# EAGLE design Falange (EAGLE 7.6.0)
CNAME: OffGrid-Devices Falange; CREVISION: B; DESIGNER: Tiago Angelo
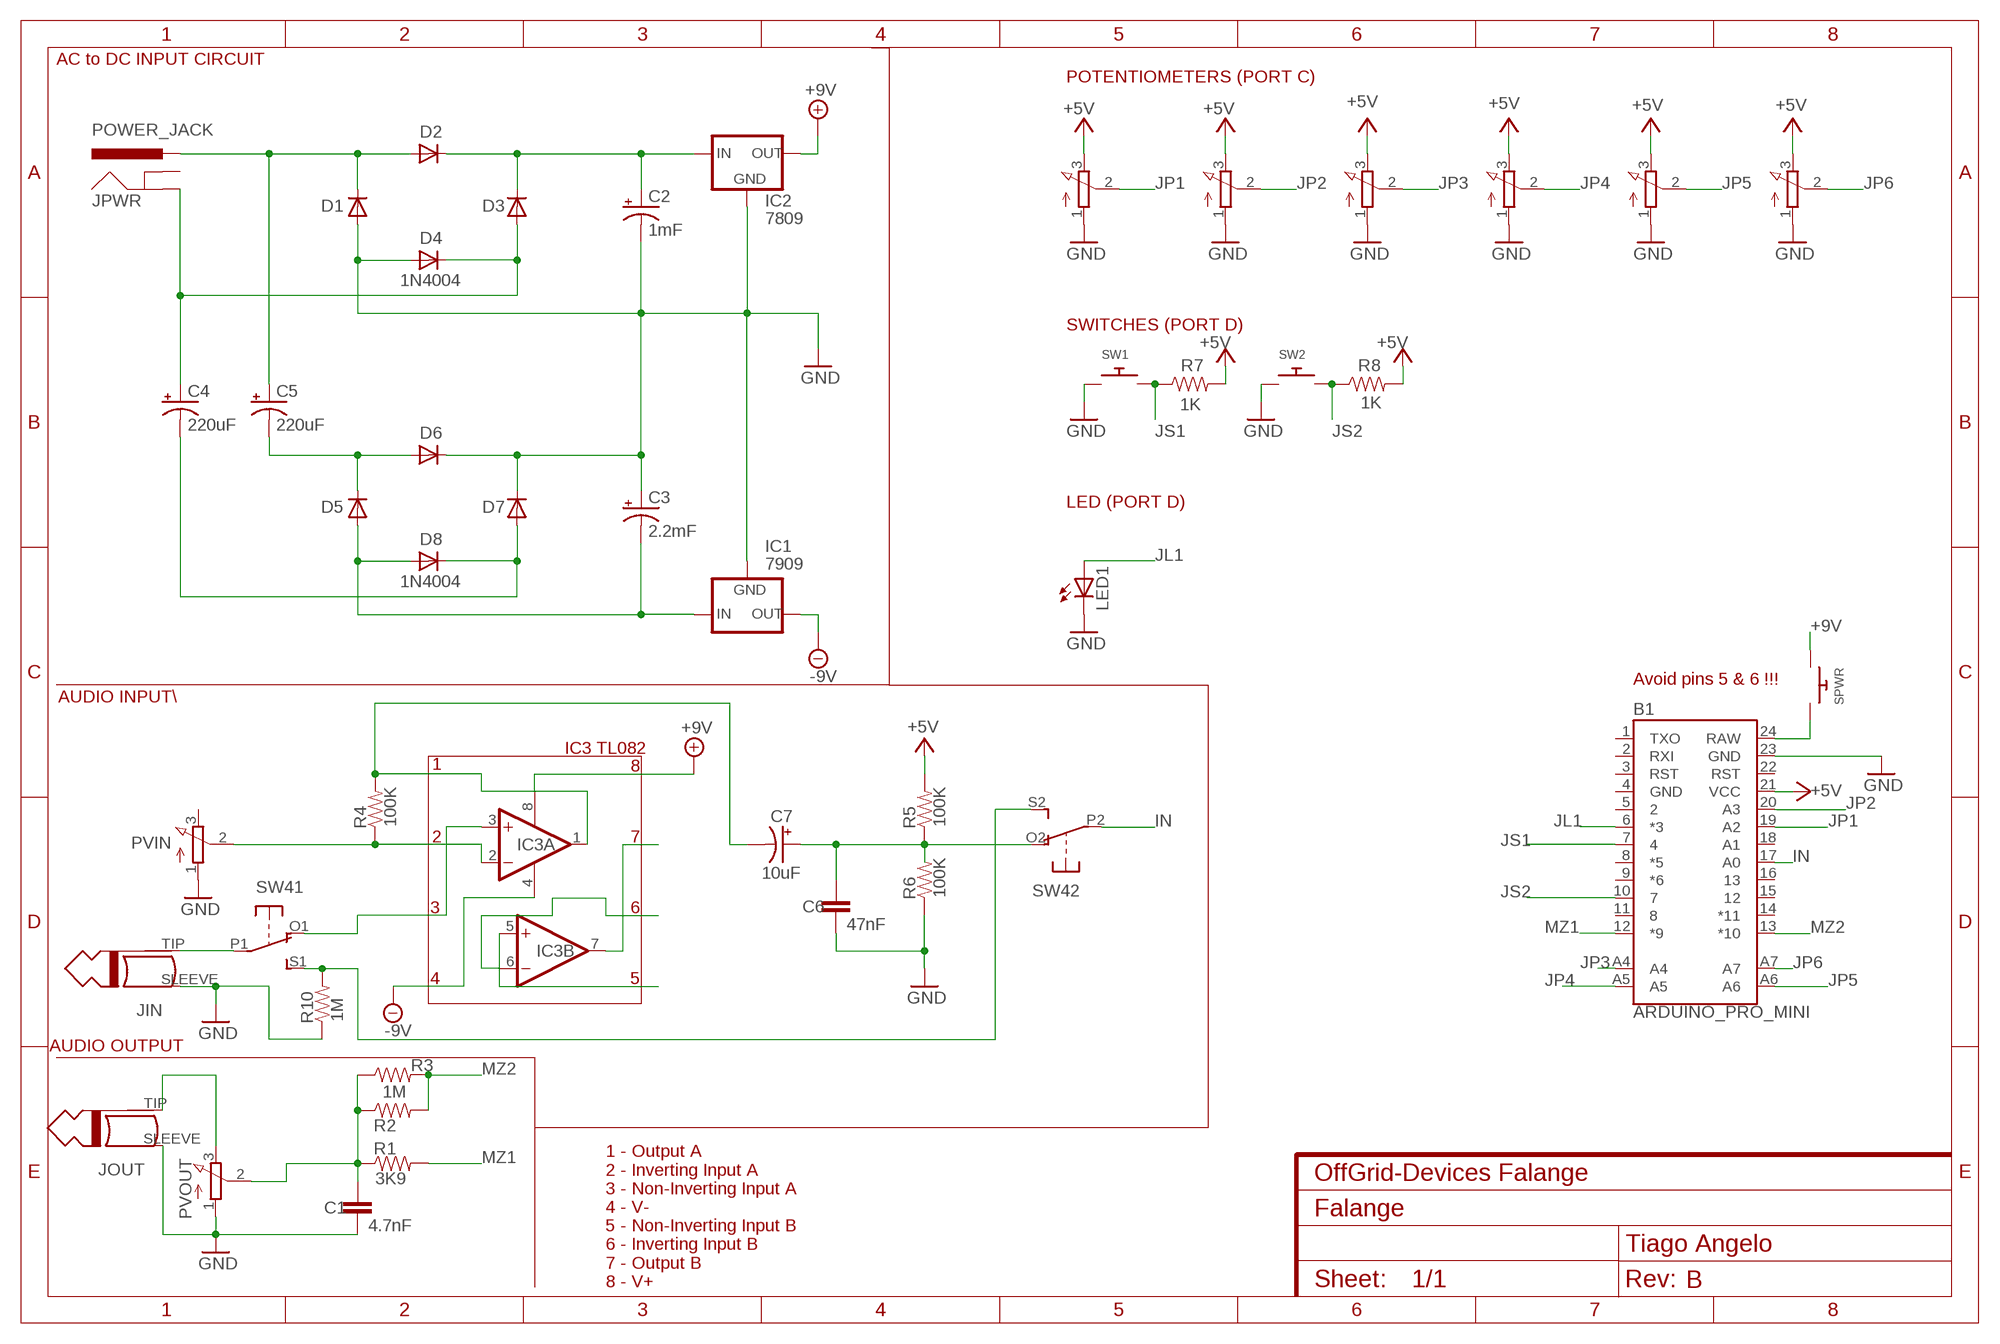
[diagram p0: schematic, sheet 1]

## Parts
B1  ARDUINO_PRO_MINI  [ARDUINO_PRO_MINI]
C1  4.7nF  C-EU050-025X075  [C050-025X075]
C2  1mF  CPOL-USE30-16AXIAL  [E30-16]
C3  2.2mF  CPOL-USE35-16AXIAL  [E35-16]
C4  220uF  CPOL-USE5-10.5  [E5-10,5]
C5  220uF  CPOL-USE5-10.5  [E5-10,5]
C6  47nF  C-EU050-025X075  [C050-025X075]
C7  10uF  CPOL-USE2.5-6  [E2,5-6]
D1  1N4004  [DO41-10]
D2  1N4004  [DO41-10]
D3  1N4004  [DO41-10]
D4  1N4004  [DO41-10]
D5  1N4004  [DO41-10]
D6  1N4004  [DO41-10]
D7  1N4004  [DO41-10]
D8  1N4004  [DO41-10]
IC1  7909  79XXL  [79XXL]
IC2  7809  78XXL  [78XXL]
IC3  TL082P  [DIL08]
JIN  MONO_PLUG  [TWO_PADS]
JOUT  MONO_PLUG  [TWO_PADS]
JPWR  POWER_JACK  [POWER_JACK_PTH]
LED1  LED3MM  [LED3MM]
P1  3RP/1610N  [3RP/1610N]
P2  3RP/1610N  [3RP/1610N]
P3  3RP/1610N  [3RP/1610N]
P4  3RP/1610N  [3RP/1610N]
P5  3RP/1610N  [3RP/1610N]
P6  3RP/1610N  [3RP/1610N]
PVIN  3RP/1610N  [3RP/1610N]
PVOUT  3RP/1610N  [3RP/1610N]
R1  3K9  1KOHM-HORIZ-1/4W-5%  [AXIAL-0.3]
R2  1M  1KOHM-HORIZ-1/4W-5%  [AXIAL-0.3]
R3  1M  1KOHM-HORIZ-1/4W-5%  [AXIAL-0.3]
R4  100K  1KOHM-HORIZ-1/4W-5%  [AXIAL-0.3]
R5  100K  1KOHM-HORIZ-1/4W-5%  [AXIAL-0.3]
R6  100K  1KOHM-HORIZ-1/4W-5%  [AXIAL-0.3]
R7  1K  1KOHM-HORIZ-1/4W-5%  [AXIAL-0.3]
R8  1K  1KOHM-HORIZ-1/4W-5%  [AXIAL-0.3]
R10  1M  1KOHM-HORIZ-1/4W-5%  [AXIAL-0.3]
SPWR  SWITCH_PUSHBUTTONEVQ-PE  [TACT_PANA-EVQ]
SW1  SWITCH_PUSHBUTTONEVQ-PE  [TACT_PANA-EVQ]
SW2  SWITCH_PUSHBUTTONEVQ-PE  [TACT_PANA-EVQ]
SW4  DPDT-EG1390  [EG1390]

## Nets
+5V: B1.21(VCC) P1.3(E) P2.3(E) P3.3(E) P4.3(E) P5.3(E) P6.3(E) R5.P$2 R7.P$2 R8.P$2
+9V: IC2.OUT IC3.8(P:V+) SPWR.P$1
-9V: IC1.OUT IC3.4(P:V-)
GND: B1.23(GND) C1.2 C2.- C3.+ C6.2 D1.A D4.A D6.C D7.C IC1.GND IC2.GND JIN.SLEEVE JOUT.SLEEVE LED1.K(C) P1.1(A) P2.1(A) P3.1(A) P4.1(A) P5.1(A) P6.1(A) PVIN.1(A) PVOUT.1(A) R6.P$1 R10.P$1 SW1.P$1 SW2.P$1
IN: B1.17(A0) R5.P$1 R6.P$2 SW4.P2(2:P)
JL1: B1.6(*3) LED1.A
JP1: B1.19(A2) P1.2(S)
JP2: B1.20(A3) P2.2(S)
JP3: B1.A4 P3.2(S)
JP4: B1.A5 P4.2(S)
JP5: B1.A6 P5.2(S)
JP6: B1.A7 P6.2(S)
JP8-2: C1.1 PVOUT.2(S) R1.P$1 R2.P$1 R3.P$1
JP8-3: JOUT.TIP PVOUT.3(E)
JS1: B1.7 R7.P$1 SW1.P$2
JS2: B1.10 R8.P$1 SW2.P$2
MZ1: B1.12(*9) R1.P$2
MZ2: B1.13(*10) R2.P$2 R3.P$2
N$2: C5.- D5.C D6.A
N$4: C4.- D7.A D8.C
N$5: C2.+ D2.C D3.C IC2.IN
N$6: B1.24(RAW) SPWR.P$2
N$7: C3.- D5.A D8.A IC1.IN
N$8: C7.- IC3.1(A:OUT) R4.P$2
N$9: IC3.2(A:-IN) PVIN.2(S) R4.P$1
N$10: JIN.TIP SW4.P1(1:P)
N$11: R10.P$2 SW4.S1(1:S) SW4.S2(2:S)
N$12: IC3.7(B:OUT)
N$13: IC3.6(B:-IN)
N$14: IC3.5(B:+IN)
N$15: IC3.3(A:+IN) SW4.O1(1:O)
N$32: C6.1 C7.+ SW4.O2(2:O)
PWRSLV: C4.+ D3.A D4.C JPWR.GND
PWRTIP: C5.+ D1.C D2.A JPWR.PWR
Unconnected: B1.1(TXO) B1.2(RXI) B1.3(RST) B1.5 B1.8(*5) B1.9(*6) B1.11 B1.14(*11) B1.15 B1.16 B1.18(A1) B1.22(RST) JPWR.GNDBREAK PVIN.3(E)

## Notes on the sheet
- AC to DC INPUT CIRCUIT
- POTENTIOMETERS (PORT C)
- SWITCHES (PORT D)
- LED (PORT D)
- Avoid pins 5 & 6 !!!
- AUDIO INPUT\
- IC3 TL082
- 1 | 8
- 2 | 7
- 3 | 6
- 4 | 5
- AUDIO OUTPUT
- 1 - Output A
  2 - Inverting Input A
  3 - Non-Inverting Input A
  4 - V-
  5 - Non-Inverting Input B
  6 - Inverting Input B
  7 - Output B
  8 - V+

## Power pins joined to a net without a drawn wire
GND: B1.4(GND)

## Library data of the parts
B1 = SparkFun-Boards:ARDUINO_PRO_MINI: SparkFun Pro Mini Pro Mini compatible footprint. Dimensions: 0.7 x 1.3" PCB Thickness: 0.8mm SparkFun Products: 3.3V/8MHz <https://www.sparkfun.com/products/11114> 5V/16MHz <https://www.sparkfun.com/products/11113>
C1 C6 = rcl:C-EU: CAPACITOR, European symbol
C2 C3 = offgrid-devices:CPOL-US: POLARIZED CAPACITOR, American symbol
C4 C5 C7 = rcl:CPOL-US: POLARIZED CAPACITOR, American symbol
D1-D8 = adafruit:1N4004: DIODE General purpose 1N400x type rectifier (With bigger pads) http://www.ladyada.net/library/pcb/eaglelibrary.html
IC1 = v-reg:79XXL: VOLTAGE REGULATOR
IC2 = v-reg:78XXL: VOLTAGE REGULATOR
IC3 = linear:TL082: OP AMP Data sheet <http://www.ti.com/lit/ds/symlink/tl084a . pdf>; DATA_SHEET: <a href="http://www.ti.com/lit/ds/symlink/tl084a.pdf"> Data sheet </a>
JIN JOUT = gm-jacks:MONO_PLUG
JPWR = SparkFun-Connectors:POWER_JACK: Power Jack Connector This is the standard 5.5mm barrel jack for power. The PTH is the most common, proven, reliable, footprint. The Slot footprint only works if the mill layer is transmitted to the PCB fab house so be warned. Here are the connectors we sell at SparkFun: DC Barrel Power Jack/Connector <https://www.sparkfun.com/products/119> (PRT-00119) DC Barrel Power Jack/Connector (SMD) <https://www.sparkfun.com/products/12748> (PRT-12748) DC Barrel Jack Adapter - Breadboard Compatible <https://www.sparkfun.com/products/10811> (PRT-10811) It is used on this SparkFun product (and many, many others): SparkFun RedBoard - Programmed with Arduino <https://www.sparkfun.com/products/12757> (DEV-12757) Also, if you need a mating power supply or connector, please check these out: Wall Adapter Power Supply - 9VDC 650mA <https://www.sparkfun.com/products/298> (TOL-00298) DC Barrel Jack Adapter - Male <https://www.sparkfun.com/products/10287> (PRT-10287); PROD_ID: CONN-08197
LED1 = led:LED: LED OSRAM: - CHIPLED LG R971, LG N971, LY N971, LG Q971, LY Q971, LO R971, LY R971 LH N974, LH R974 LS Q976, LO Q976, LY Q976 LO Q996 - Hyper CHIPLED LW Q18S LB Q993, LB Q99A, LB R99A - SideLED LS A670, LO A670, LY A670, LG A670, LP A670 LB A673, LV A673, LT A673, LW A673 LH A674 LY A675 LS A676, LA A676, LO A676, LY A676, LW A676 LS A679, LY A679, LG A679 - Hyper Micro SIDELED® LS Y876, LA Y876, LO Y876, LY Y876 LT Y87S - SmartLED LW L88C, LW L88S LB L89C, LB L89S, LG L890 LS L89K, LO L89K, LY L89K LS L896, LA L896, LO L896, LY L896 - TOPLED LS T670, LO T670, LY T670, LG T670, LP T670 LSG T670, LSP T670, LSY T670, LOP T670, LYG T670 LG T671, LOG T671, LSG T671 LB T673, LV T673, LT T673, LW T673 LH T674 LS T676, LA T676, LO T676, LY T676, LB T676, LH T676, LSB T676, LW T676 LB T67C, LV T67C, LT T67C, LS T67K, LO T67K, LY T67K, LW E67C LS E67B, LA E67B, LO E67B, LY E67B, LB E67C, LV E67C, LT E67C LW T67C LS T679, LY T679, LG T679 LS T770, LO T770, LY T770, LG T770, LP T770 LB T773, LV T773, LT T773, LW T773 LH T774 LS E675, LA E675, LY E675, LS T675 LS T776, LA T776, LO T776, LY T776, LB T776 LHGB T686 LT T68C, LB T68C - Hyper Mini TOPLED® LB M676 - Mini TOPLED Santana® LG M470 LS M47K, LO M47K, LY M47K Source: http://www.osram.convergy.de LUXEON: - LUMILED® LXK2-PW12-R00, LXK2-PW12-S00, LXK2-PW14-U00, LXK2-PW14-V00 LXK2-PM12-R00, LXK2-PM12-S00, LXK2-PM14-U00 LXK2-PE12-Q00, LXK2-PE12-R00, LXK2-PE12-S00, LXK2-PE14-T00, LXK2-PE14-U00 LXK2-PB12-K00, LXK2-PB12-L00, LXK2-PB12-M00, LXK2-PB14-N00, LXK2-PB14-P00, LXK2-PB14-Q00 LXK2-PR12-L00, LXK2-PR12-M00, LXK2-PR14-Q00, LXK2-PR14-R00 LXK2-PD12-Q00, LXK2-PD12-R00, LXK2-PD12-S00 LXK2-PH12-R00, LXK2-PH12-S00 LXK2-PL12-P00, LXK2-PL12-Q00, LXK2-PL12-R00 Source: www.luxeon.com KINGBRIGHT: KA-3528ASYC Source: www.kingbright.com
P1-P6 PVIN PVOUT = pot:3RP/1610N: 16mm Potentiometer one level Source: http://www.alphapotentiometers.net/html/16mm_pot_2.html
R1-R8 R10 = SparkFun-Resistors:1KOHM: 1kΩ resistor A resistor is a passive two-terminal electrical component that implements electrical resistance as a circuit element. Resistors act to reduce current flow, and, at the same time, act to lower voltage levels within circuits. - Wikipedia; PROD_ID: RES-08380; VALUE: 1k
SPWR SW1 SW2 = adafruit:SWITCH_PUSHBUTTON: Buttons SOFTTOUCHSMD_SJ - Soft touch temporary push button (Super Junk Akihabara) Compatible with SKPMANE010 [Mouser: 688-SKPMAN] C&K_KSS = Digikey: KSS221GLFS
SW4 = adafruit:DPDT

## Net classes
0 default: width 0.508 mm, drill 0.508 mm, clearance 0.406 mm

## Board
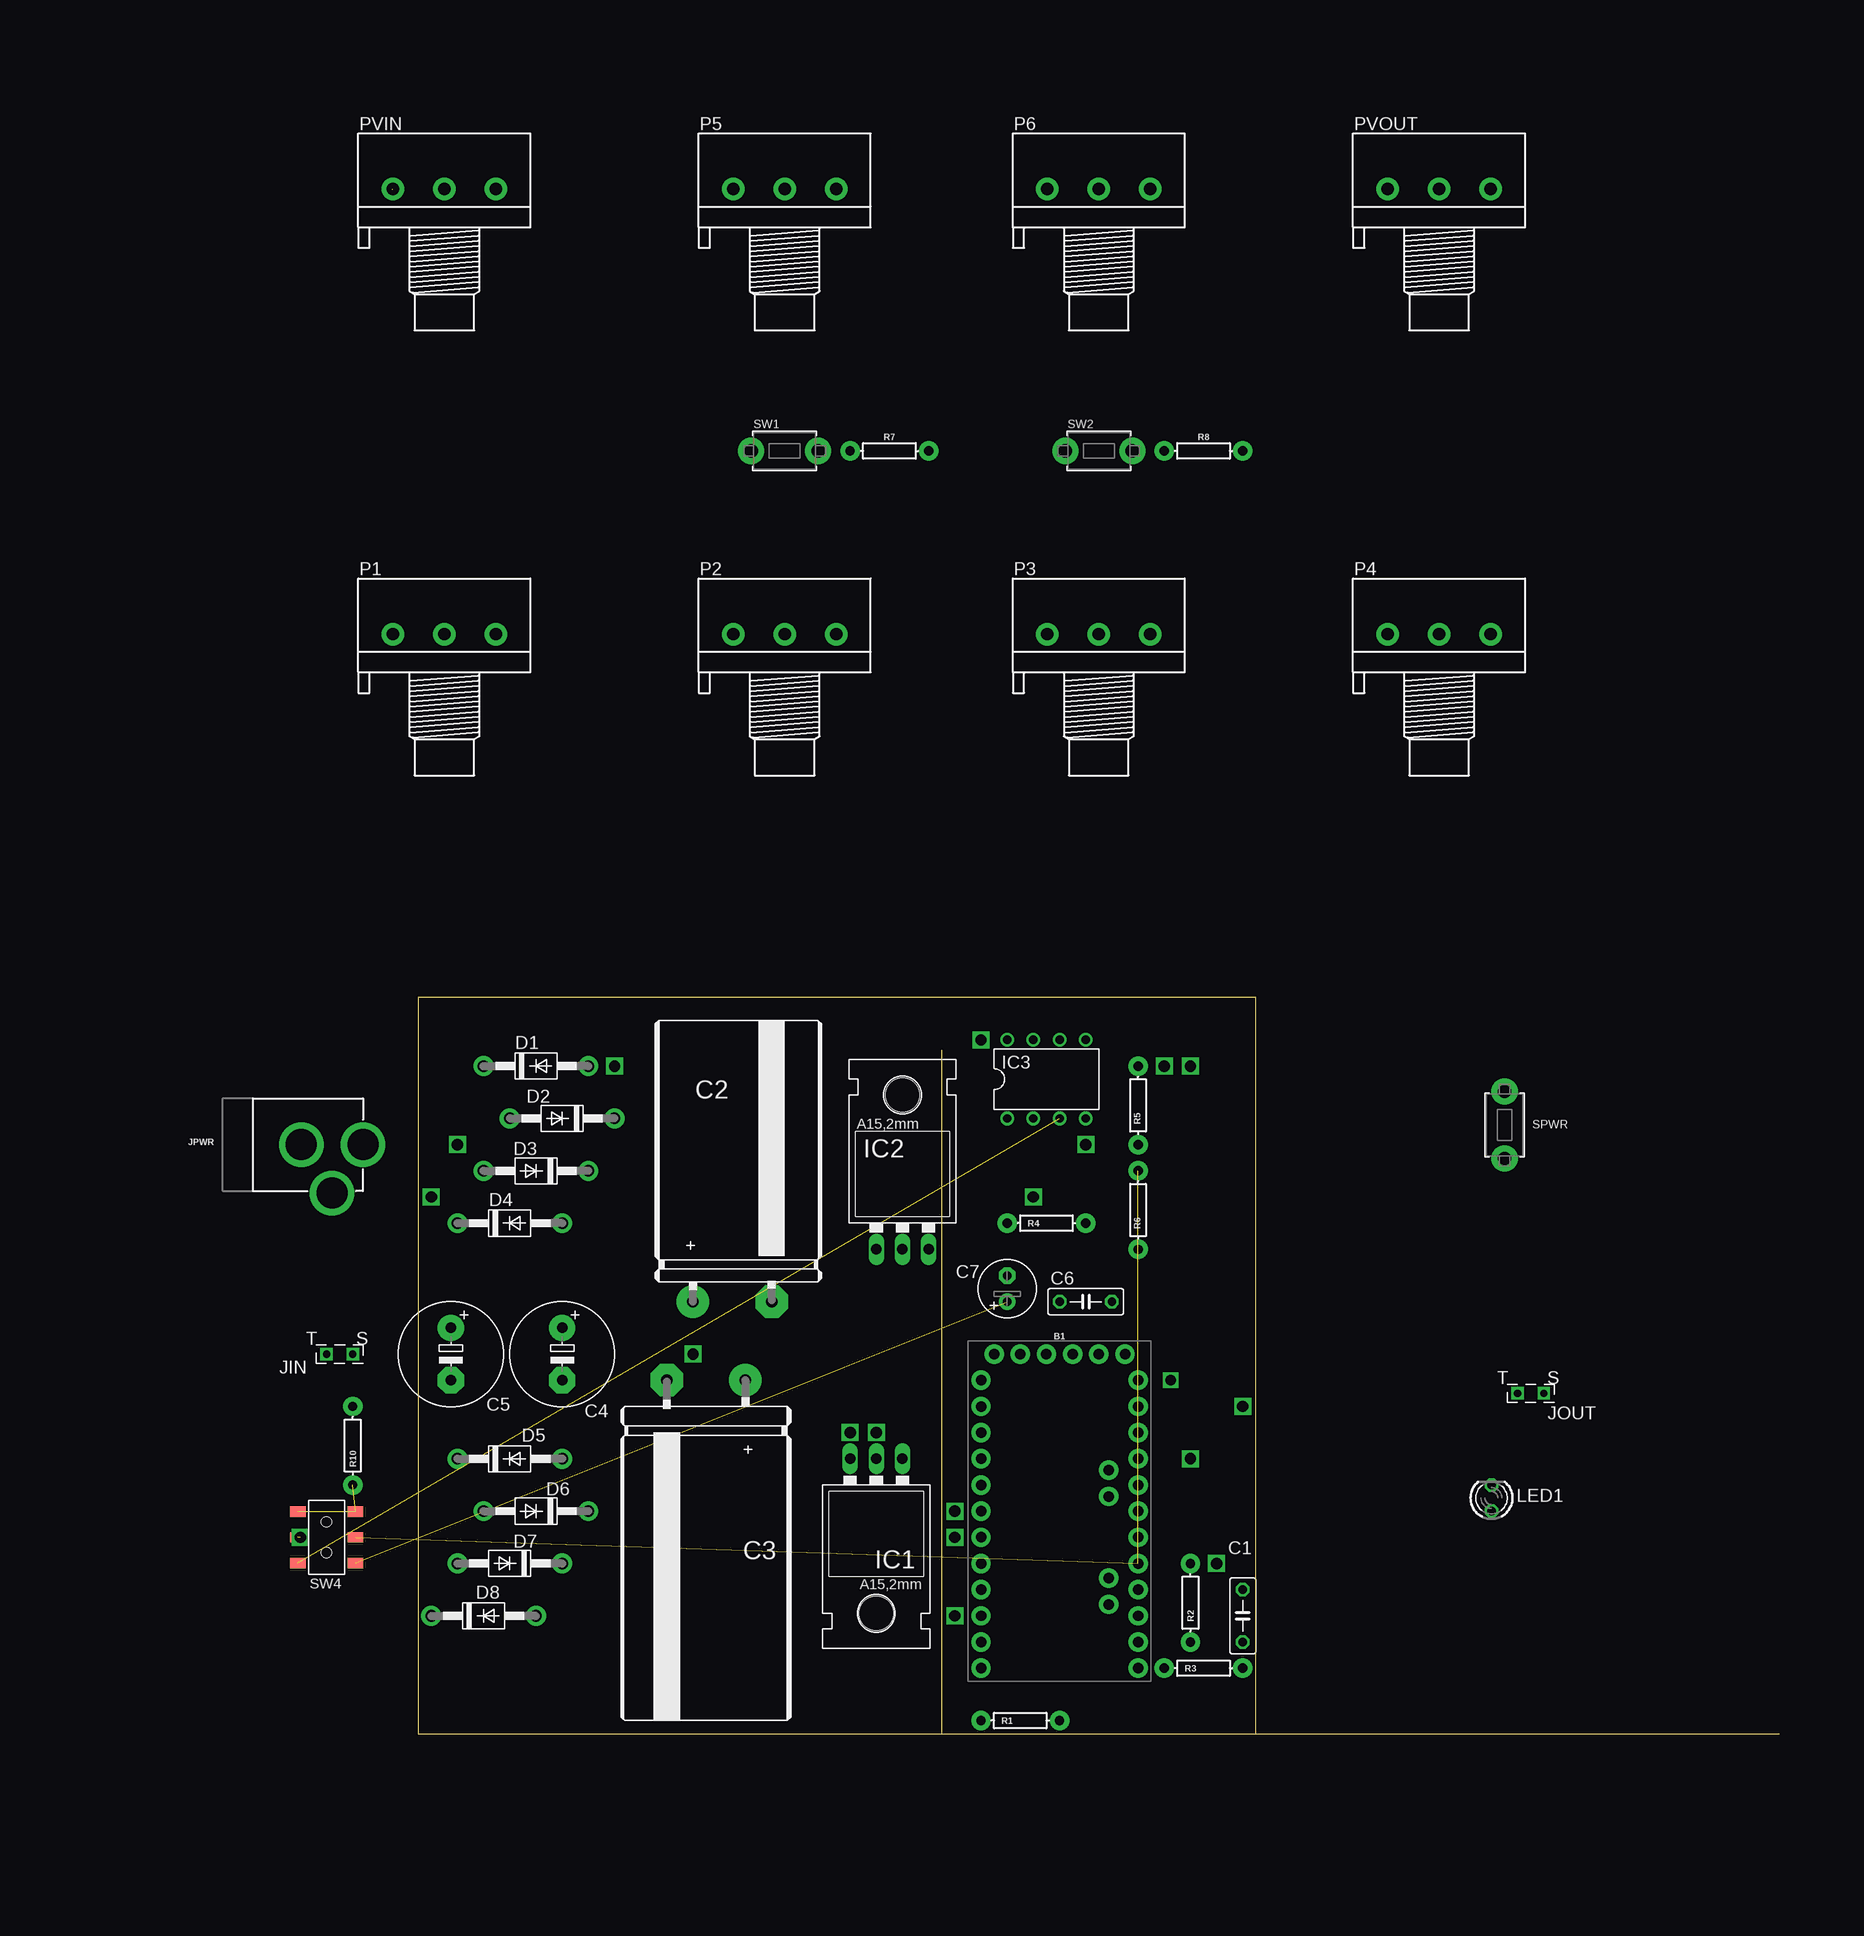
[diagram p1: board, top side]
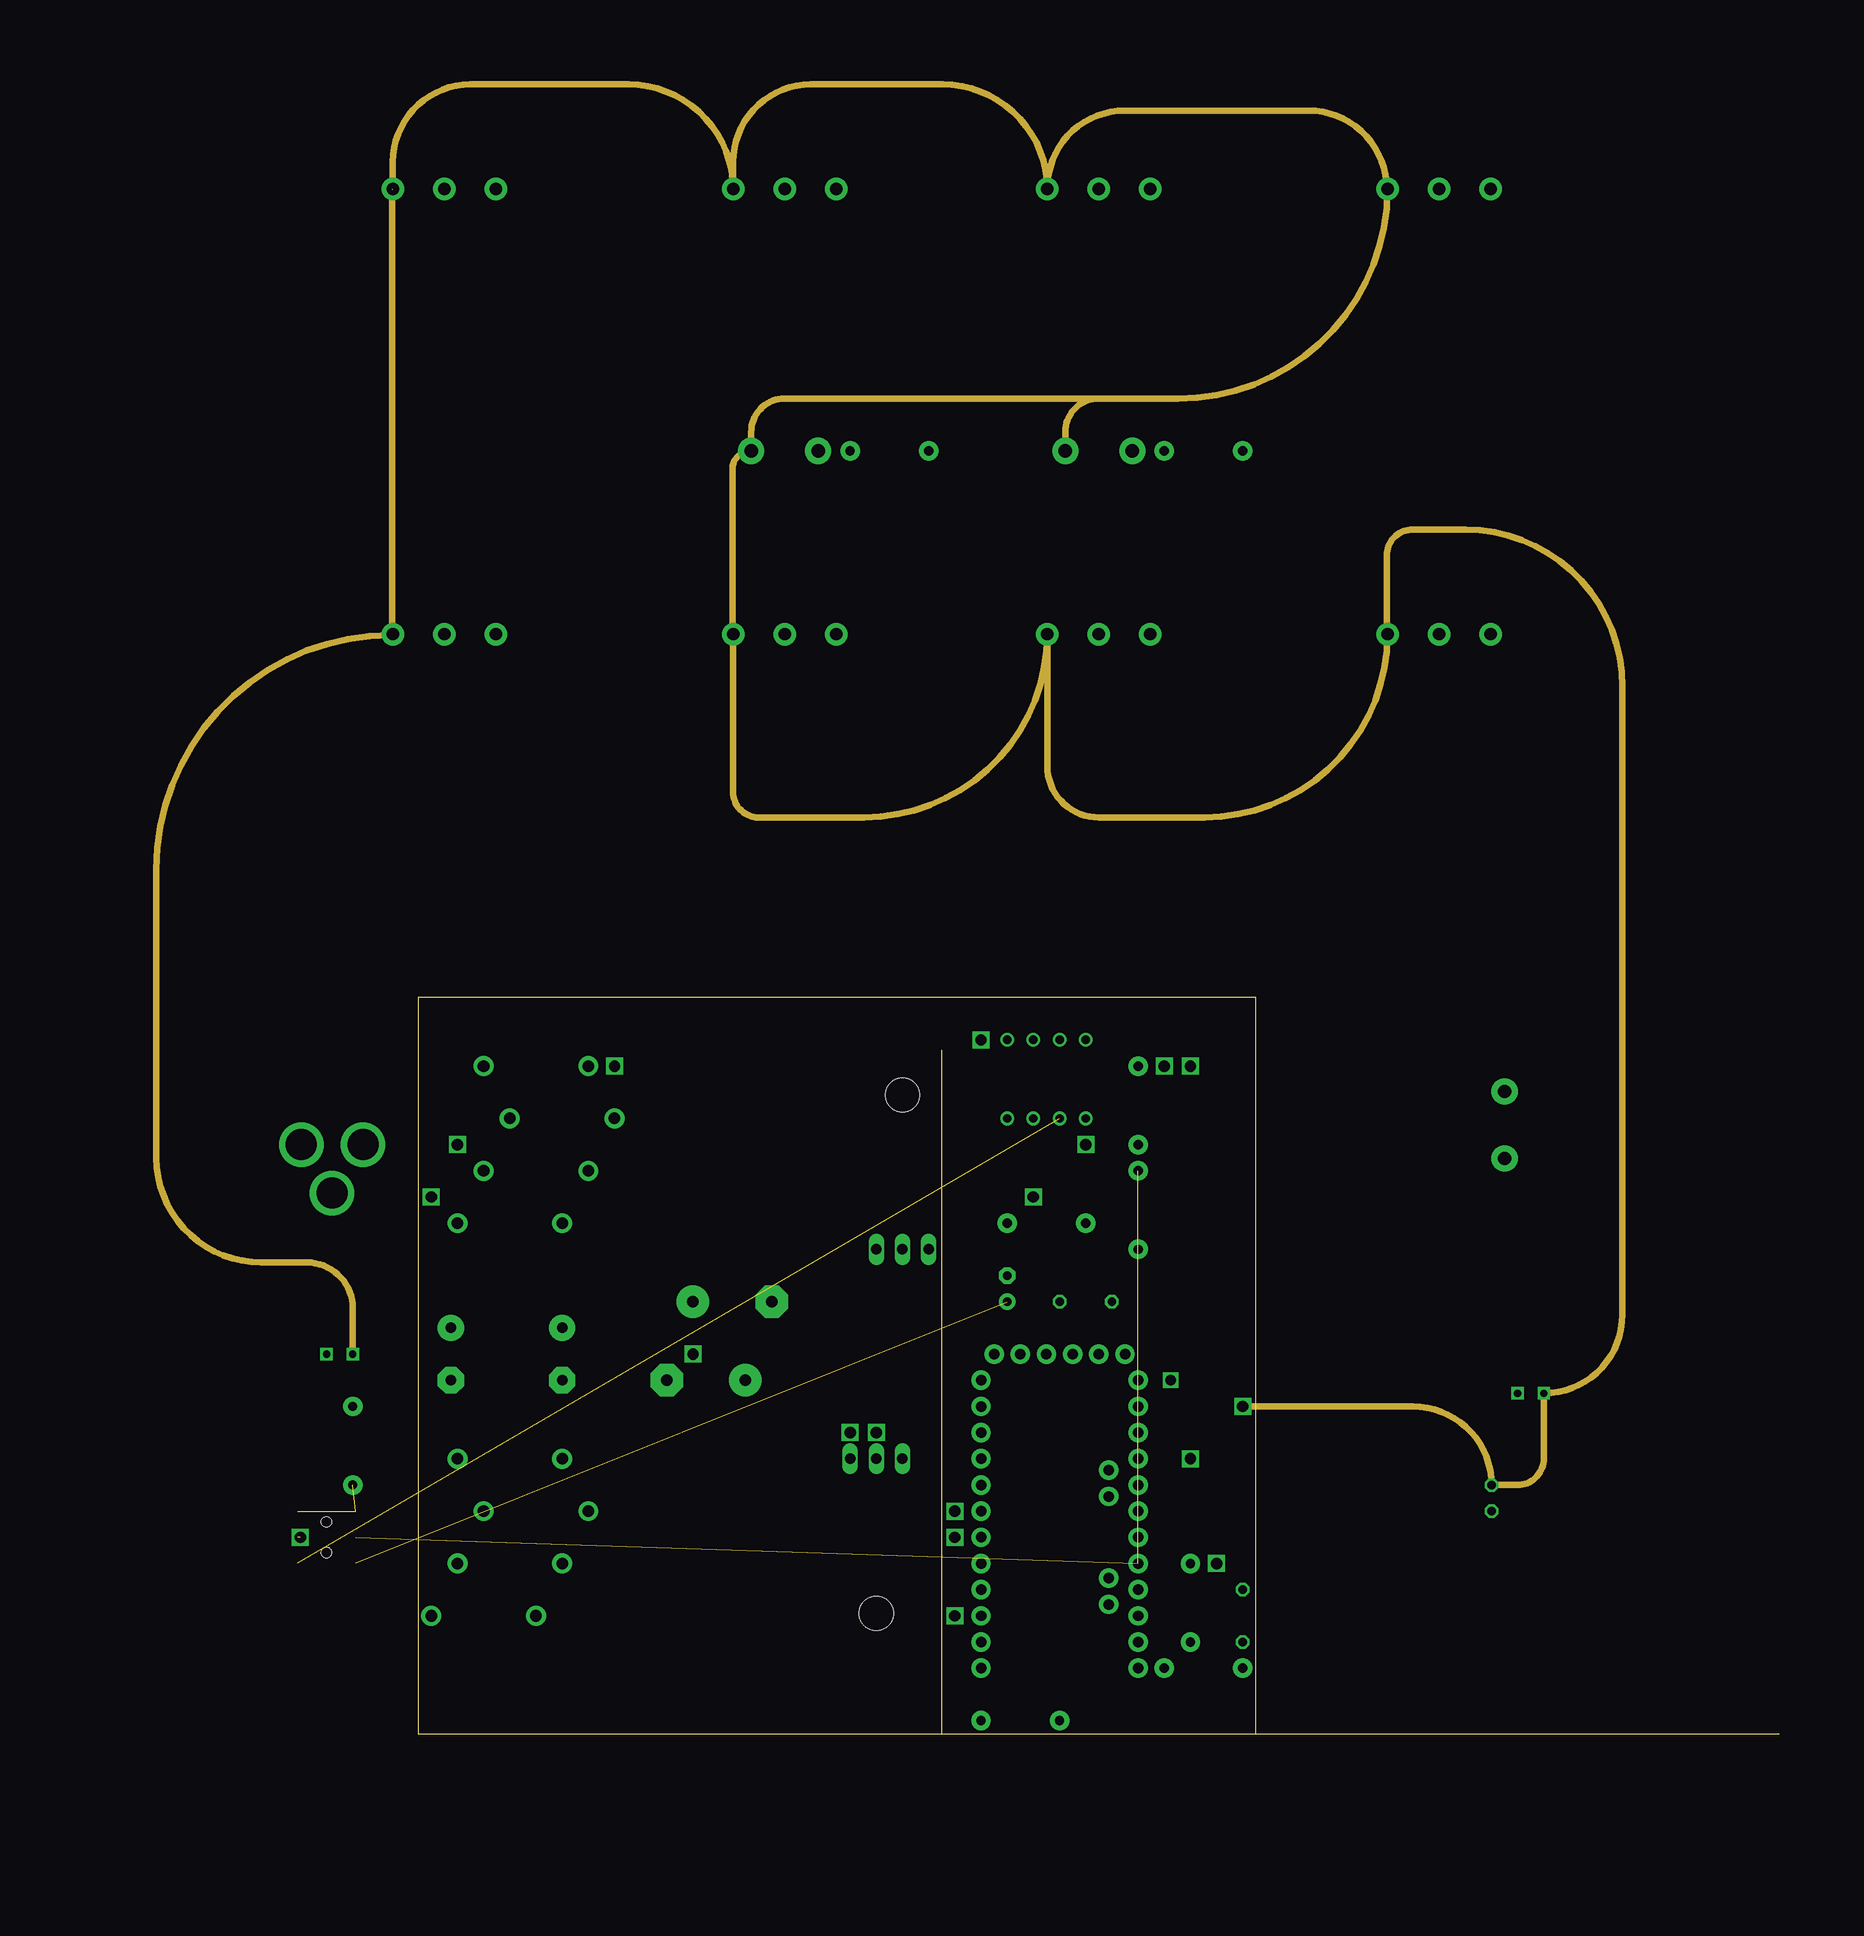
[diagram p2: board, inner layer Ground]
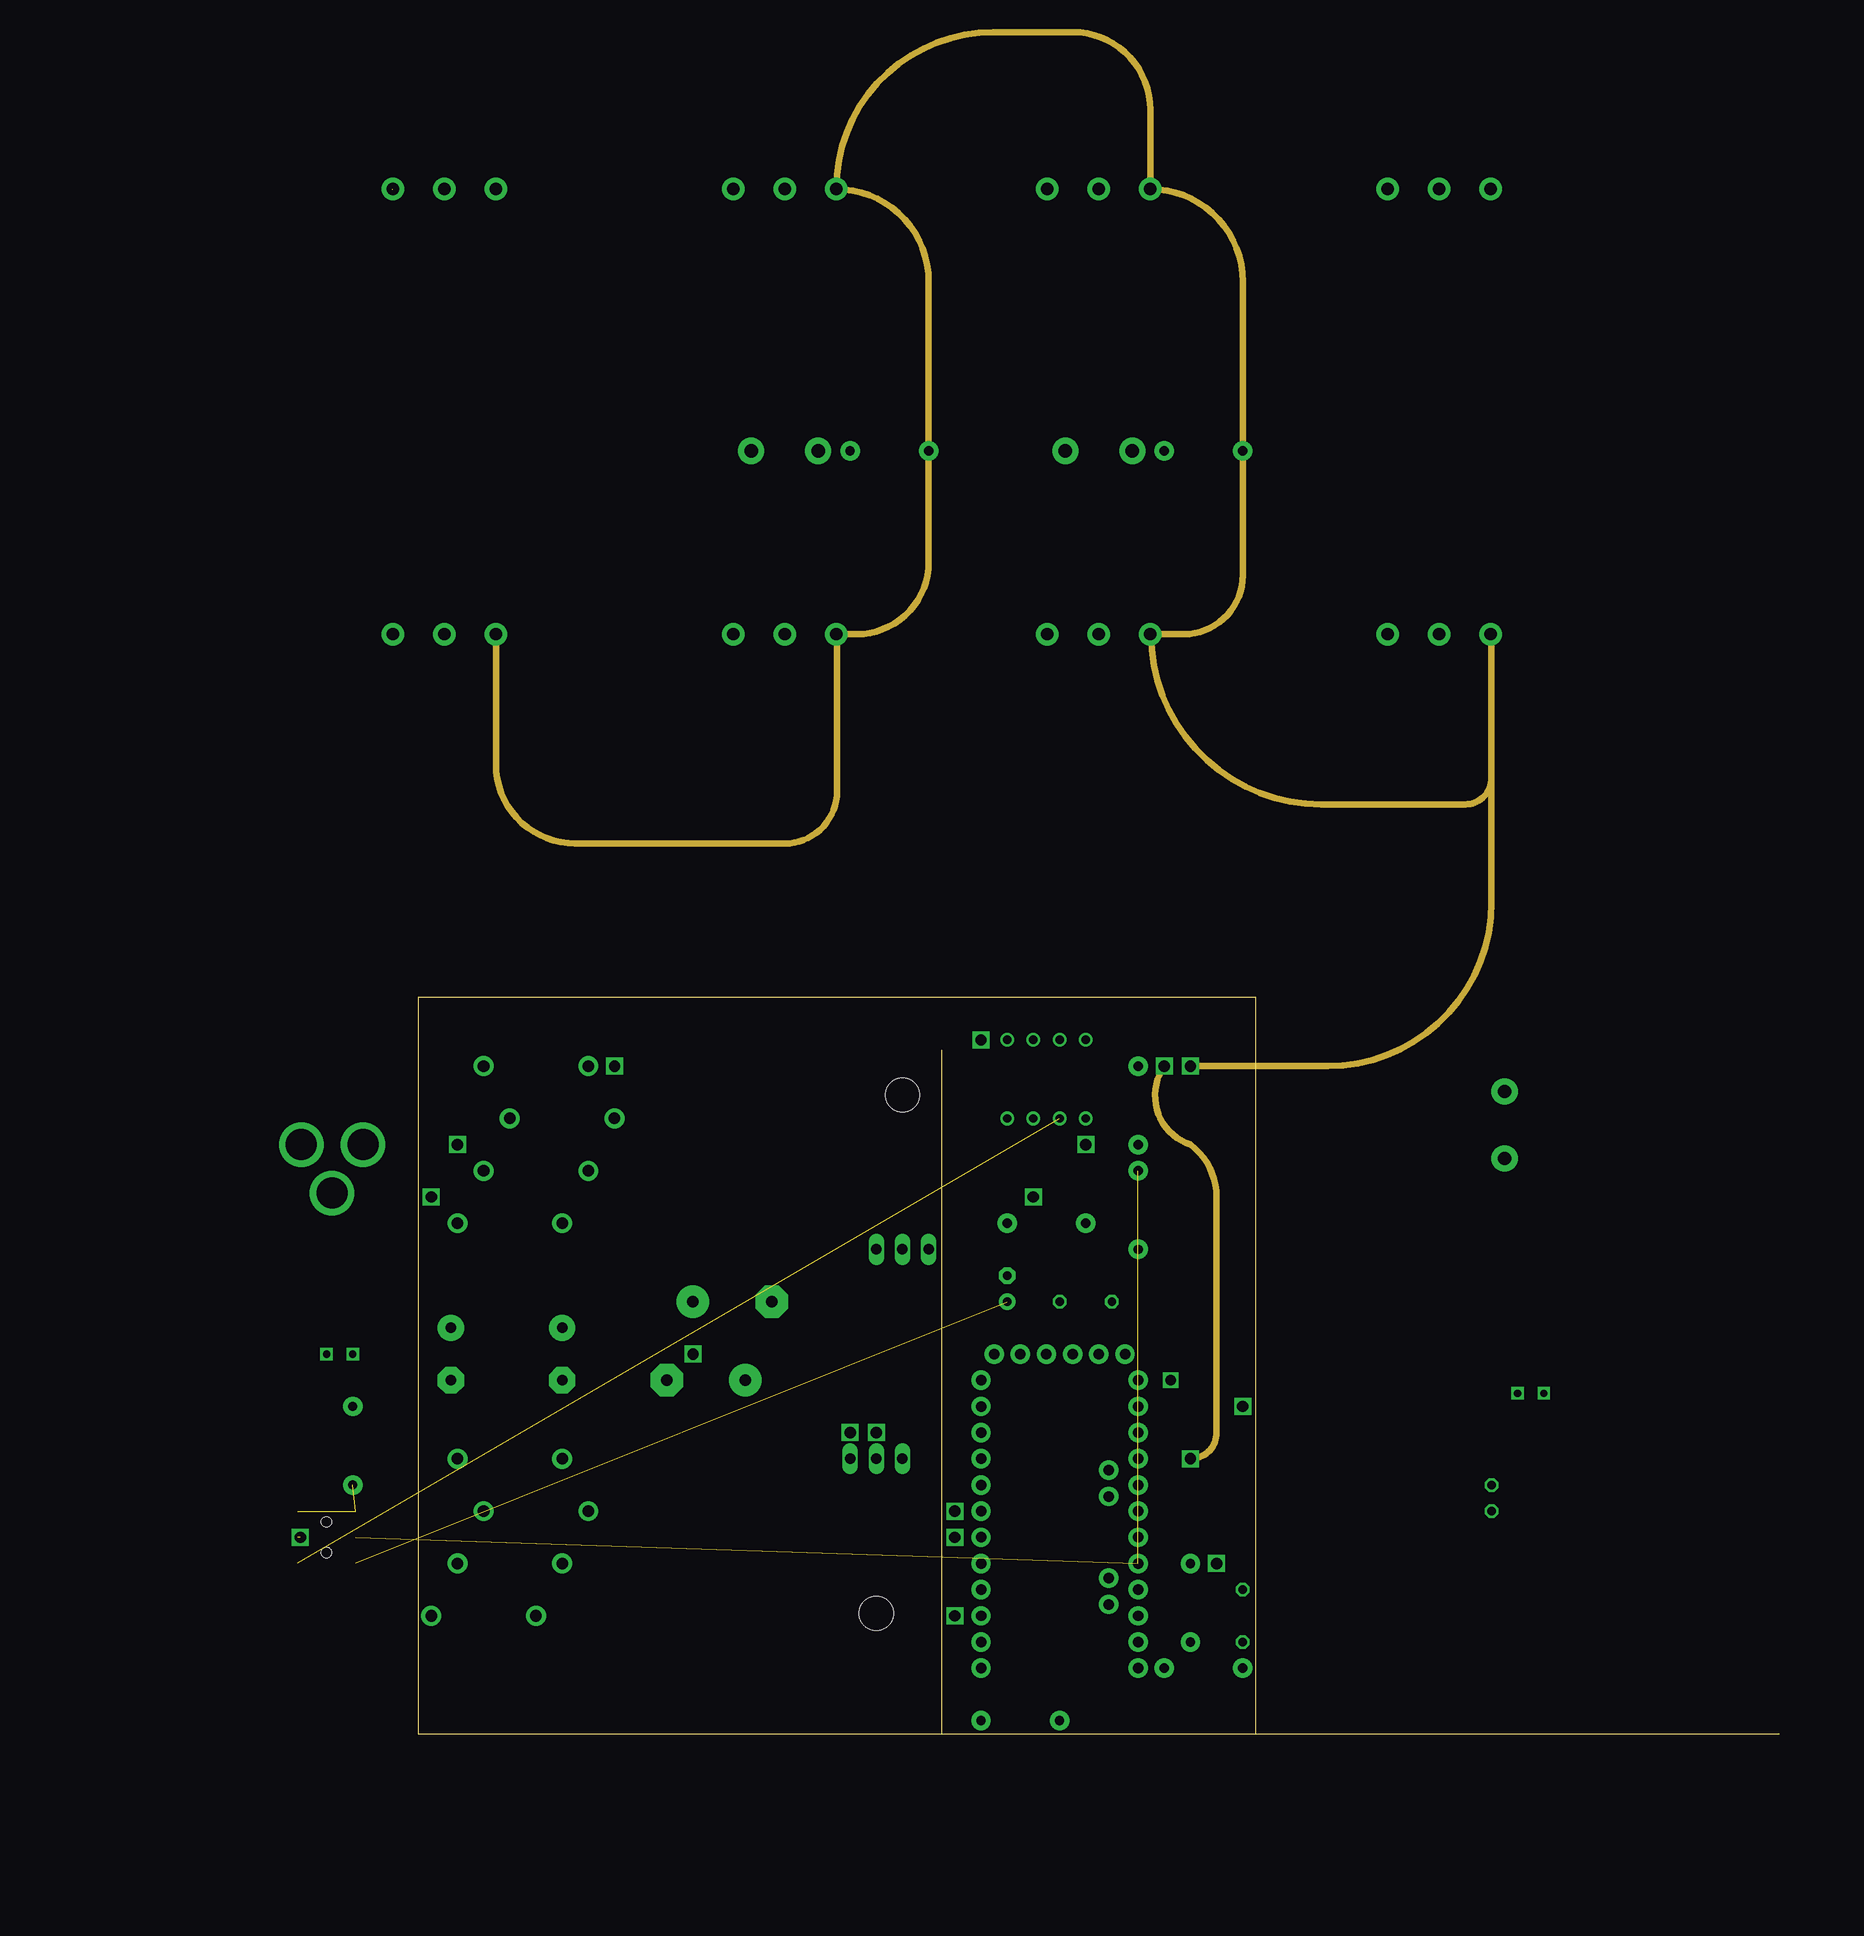
[diagram p3: board, inner layer 5V]
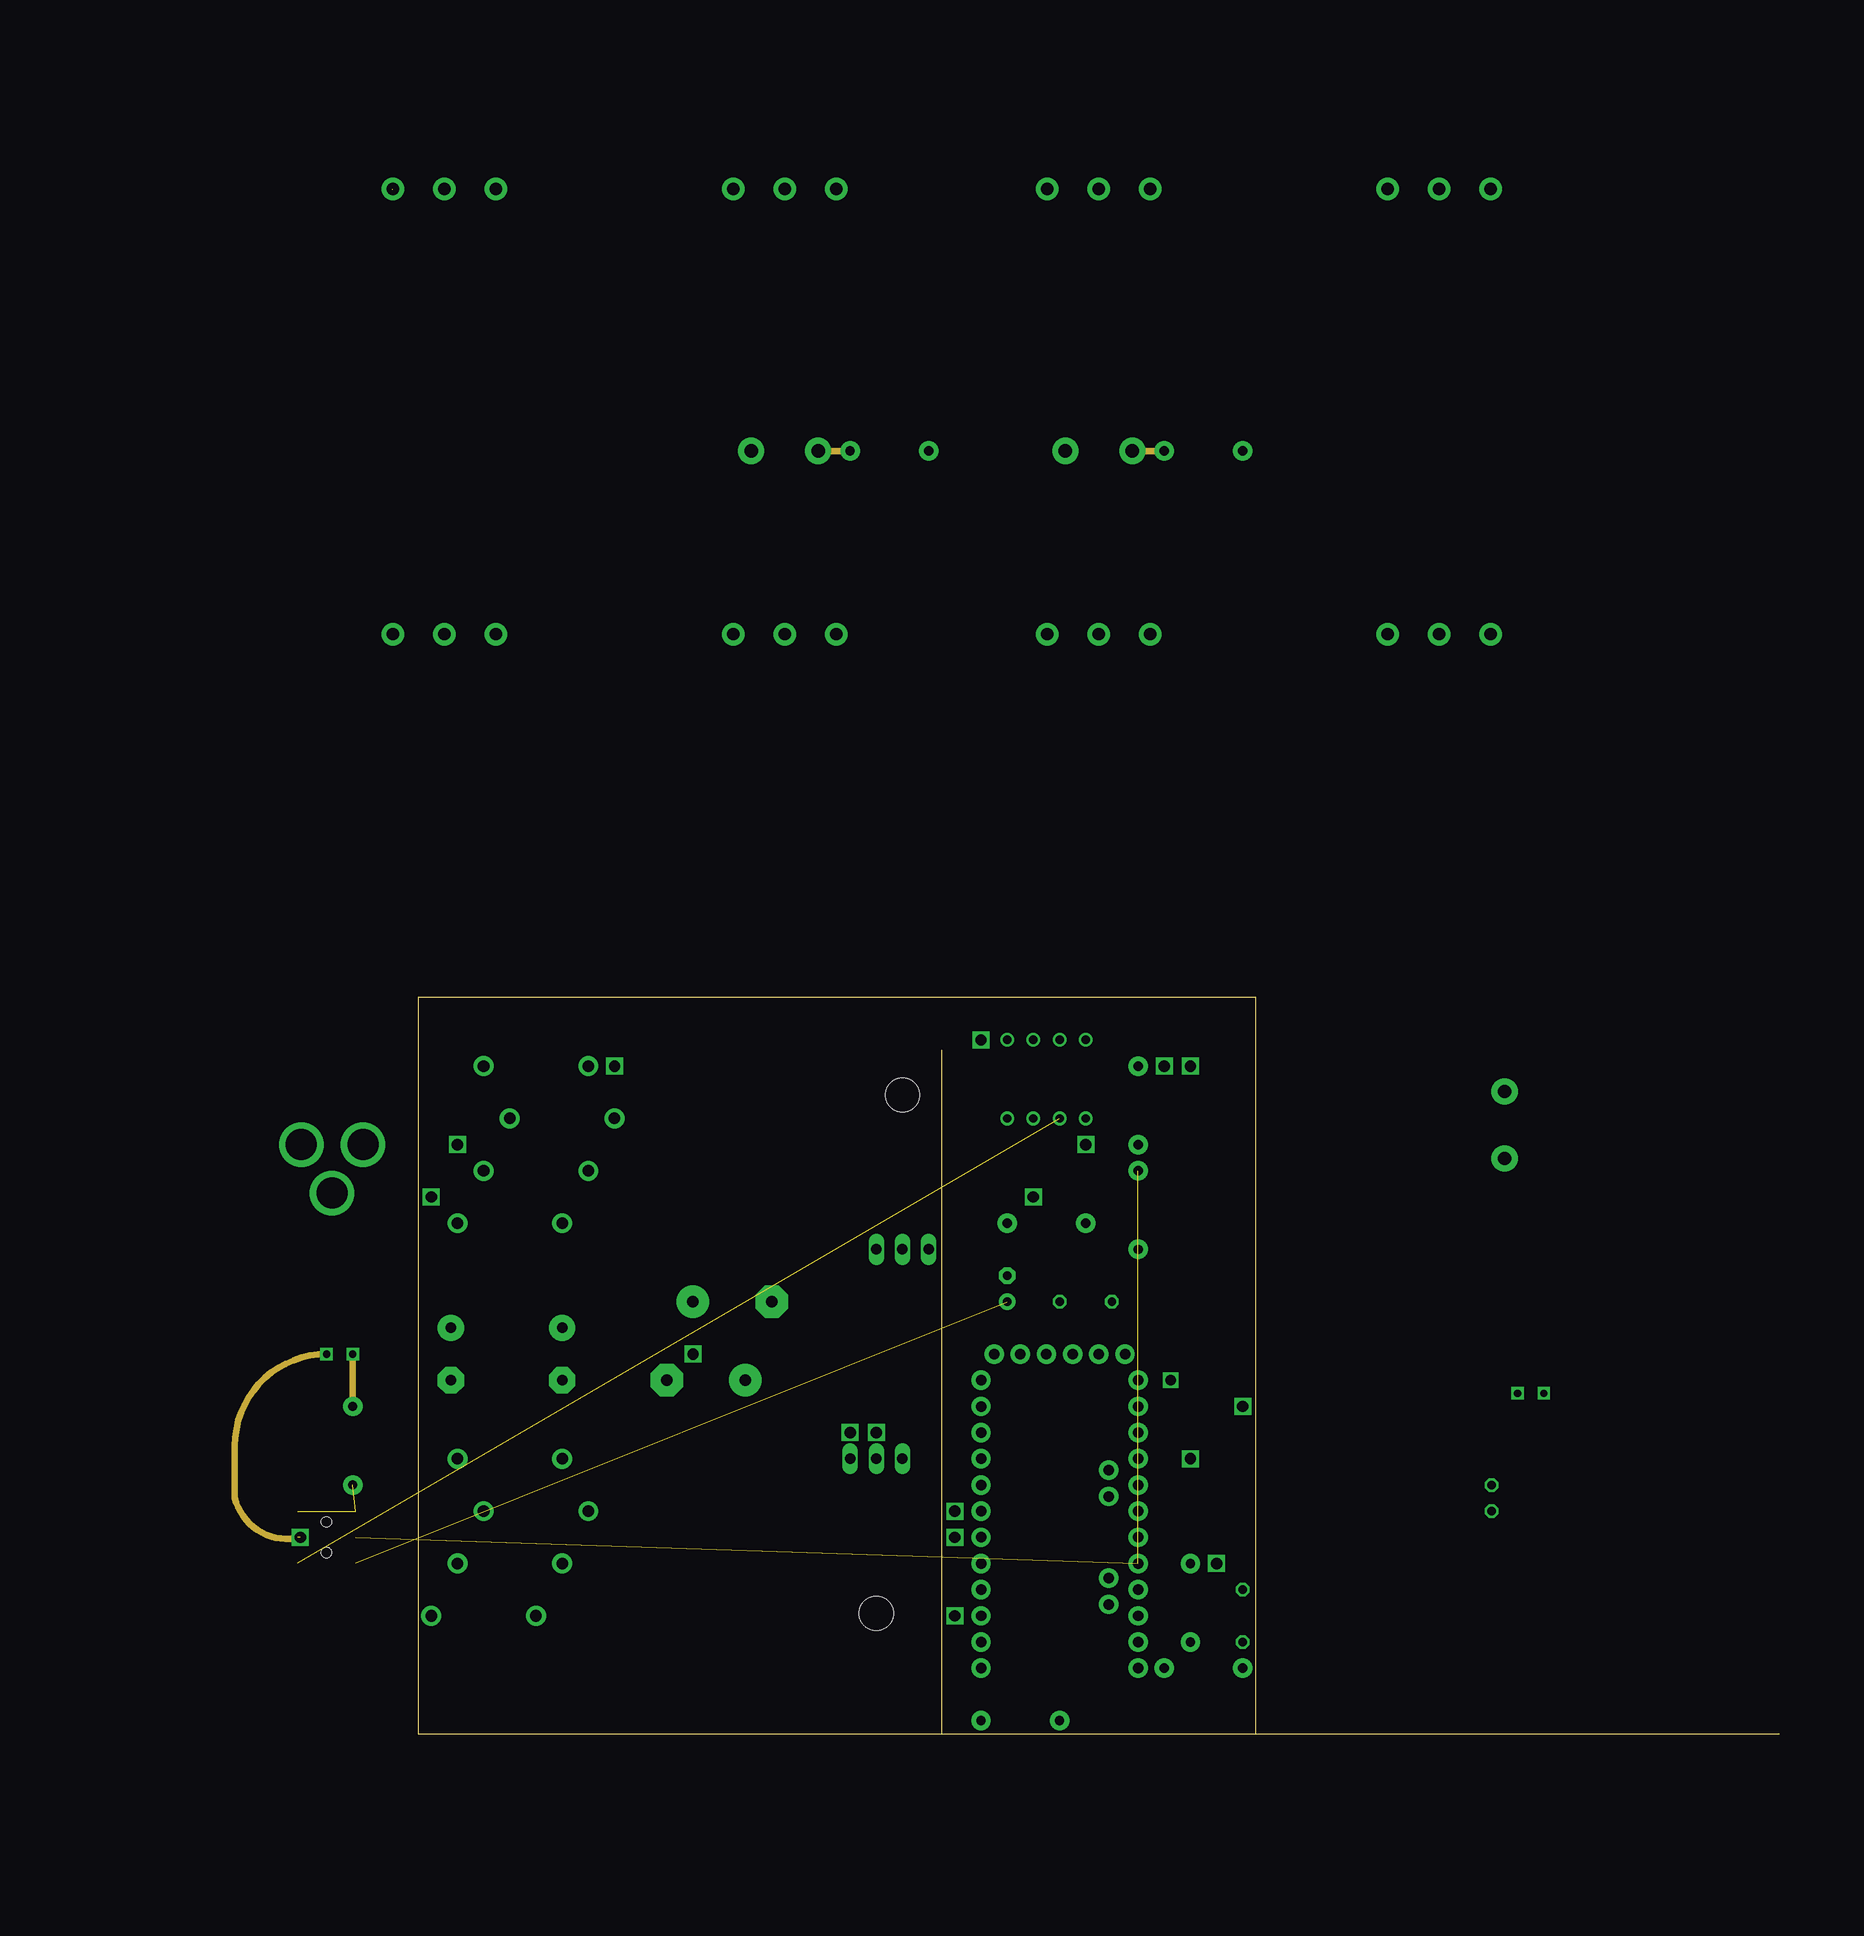
[diagram p4: board, inner layer Component2Component]
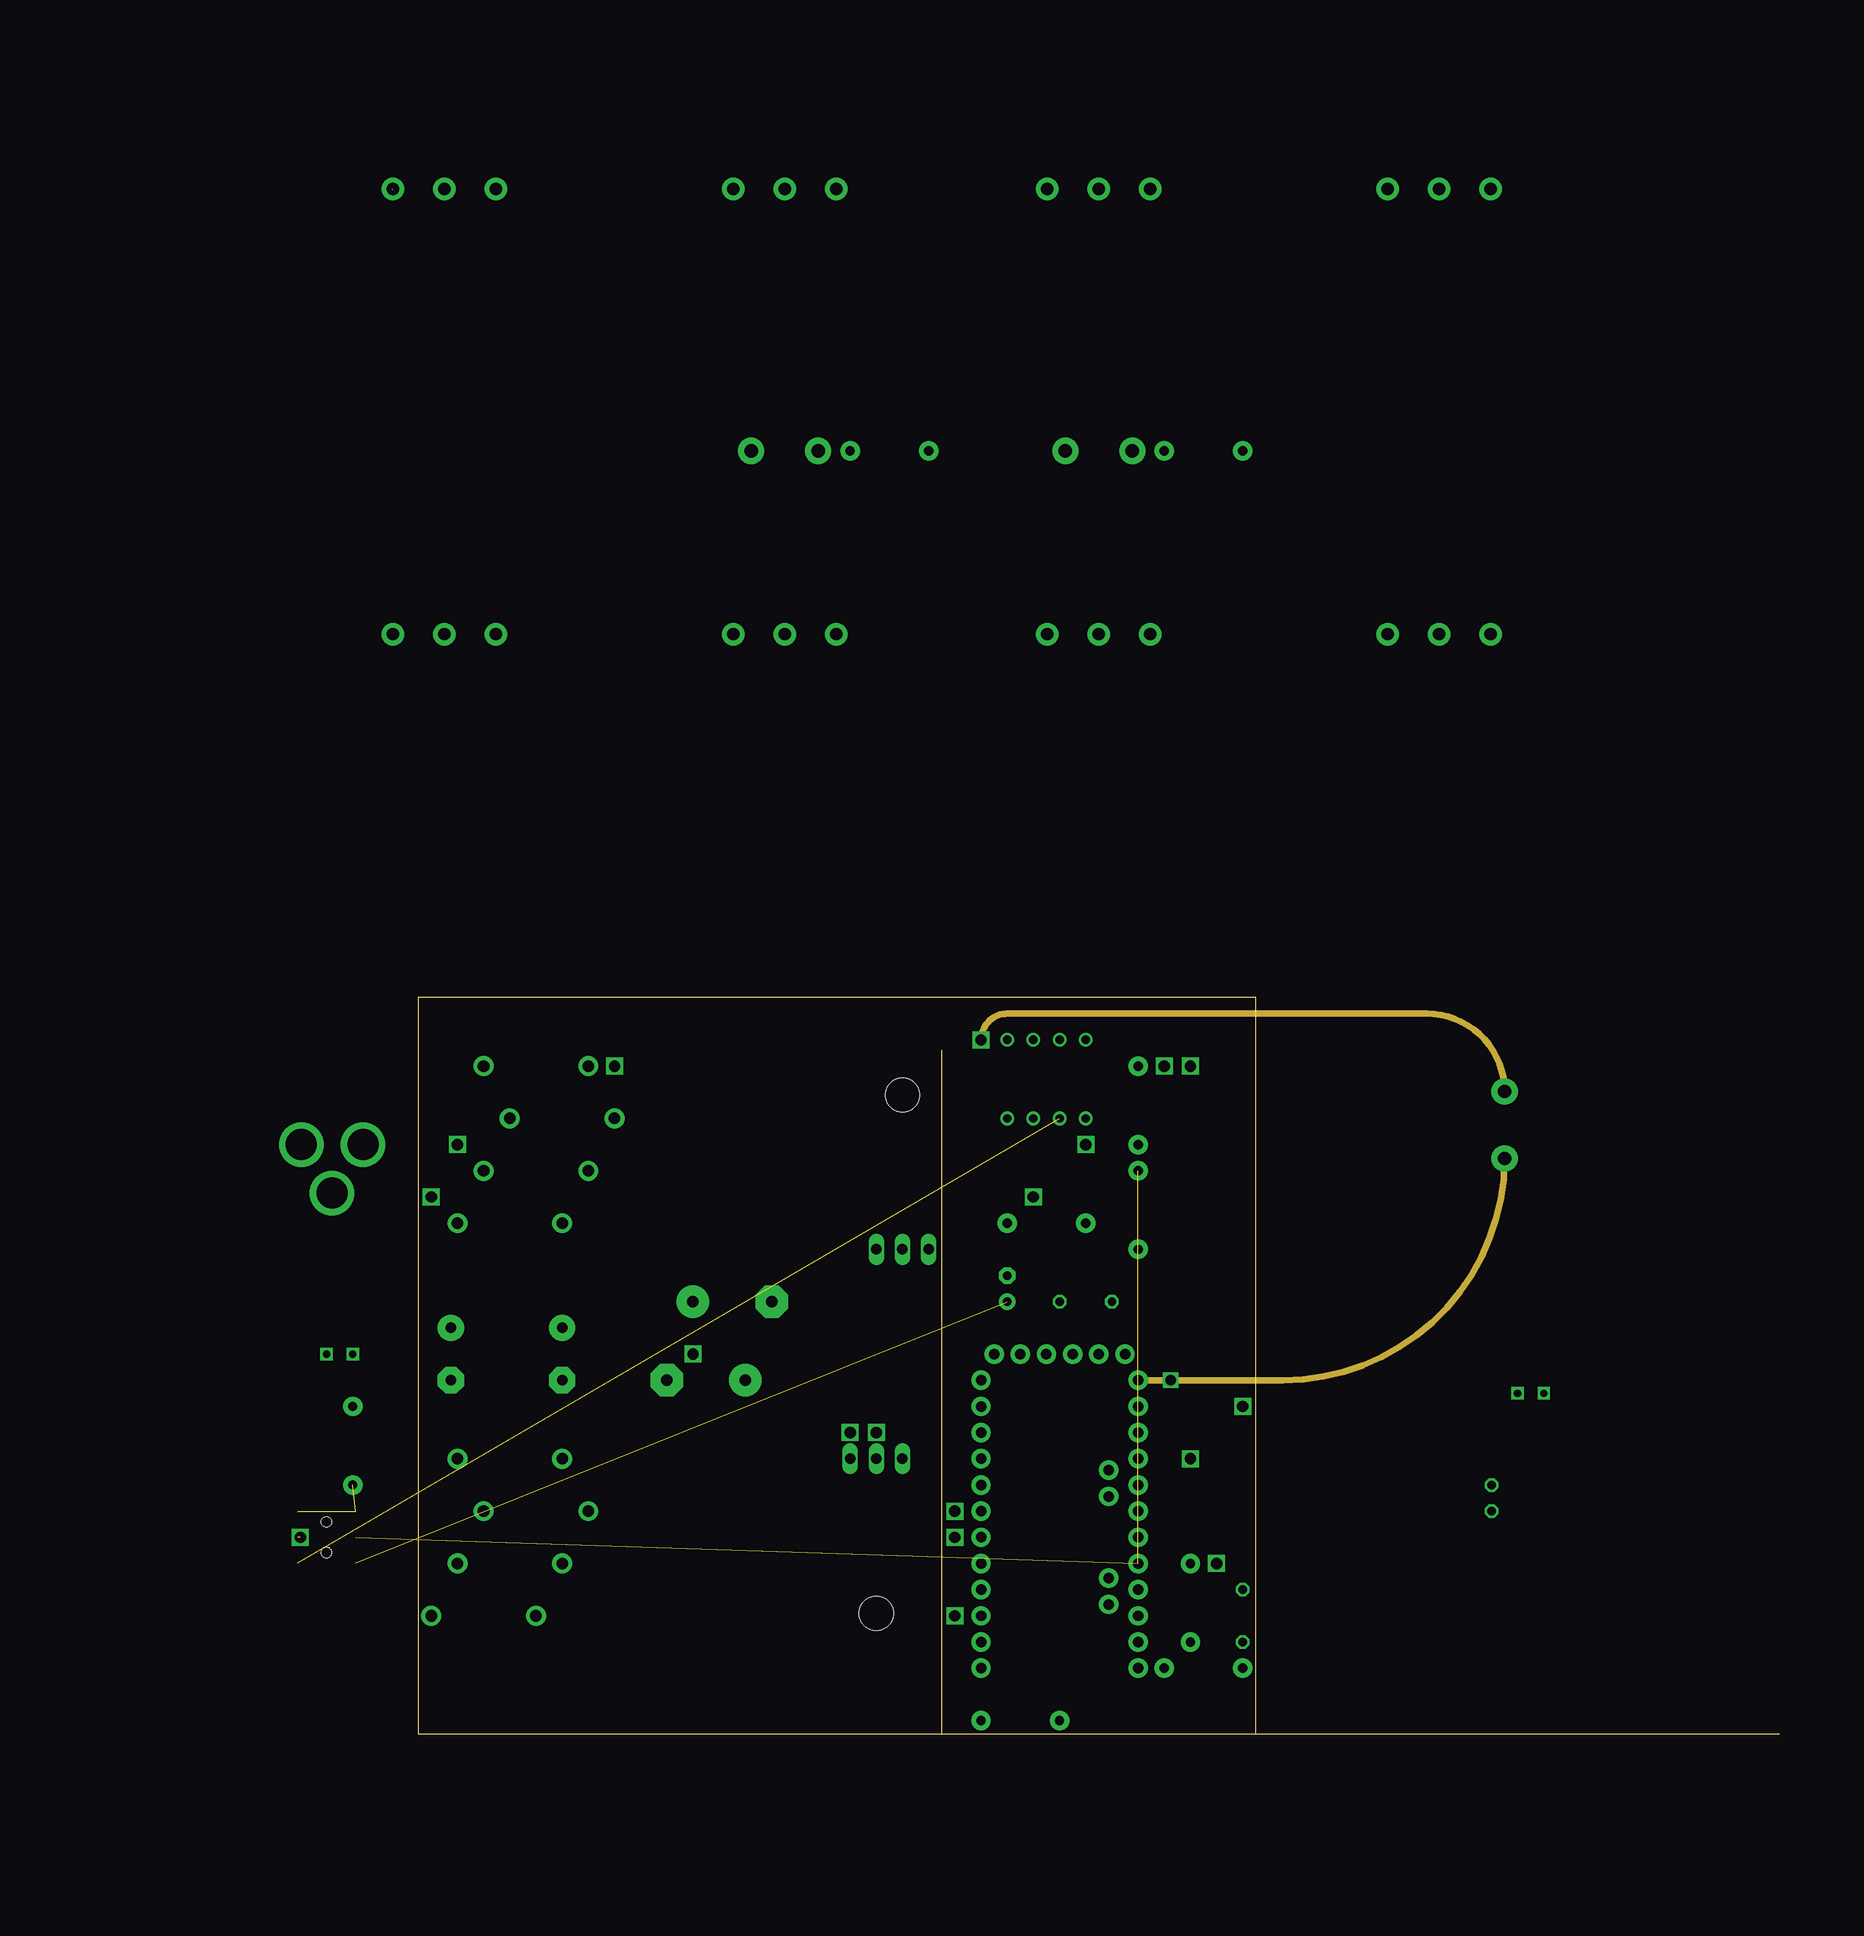
[diagram p5: board, inner layer +9V]
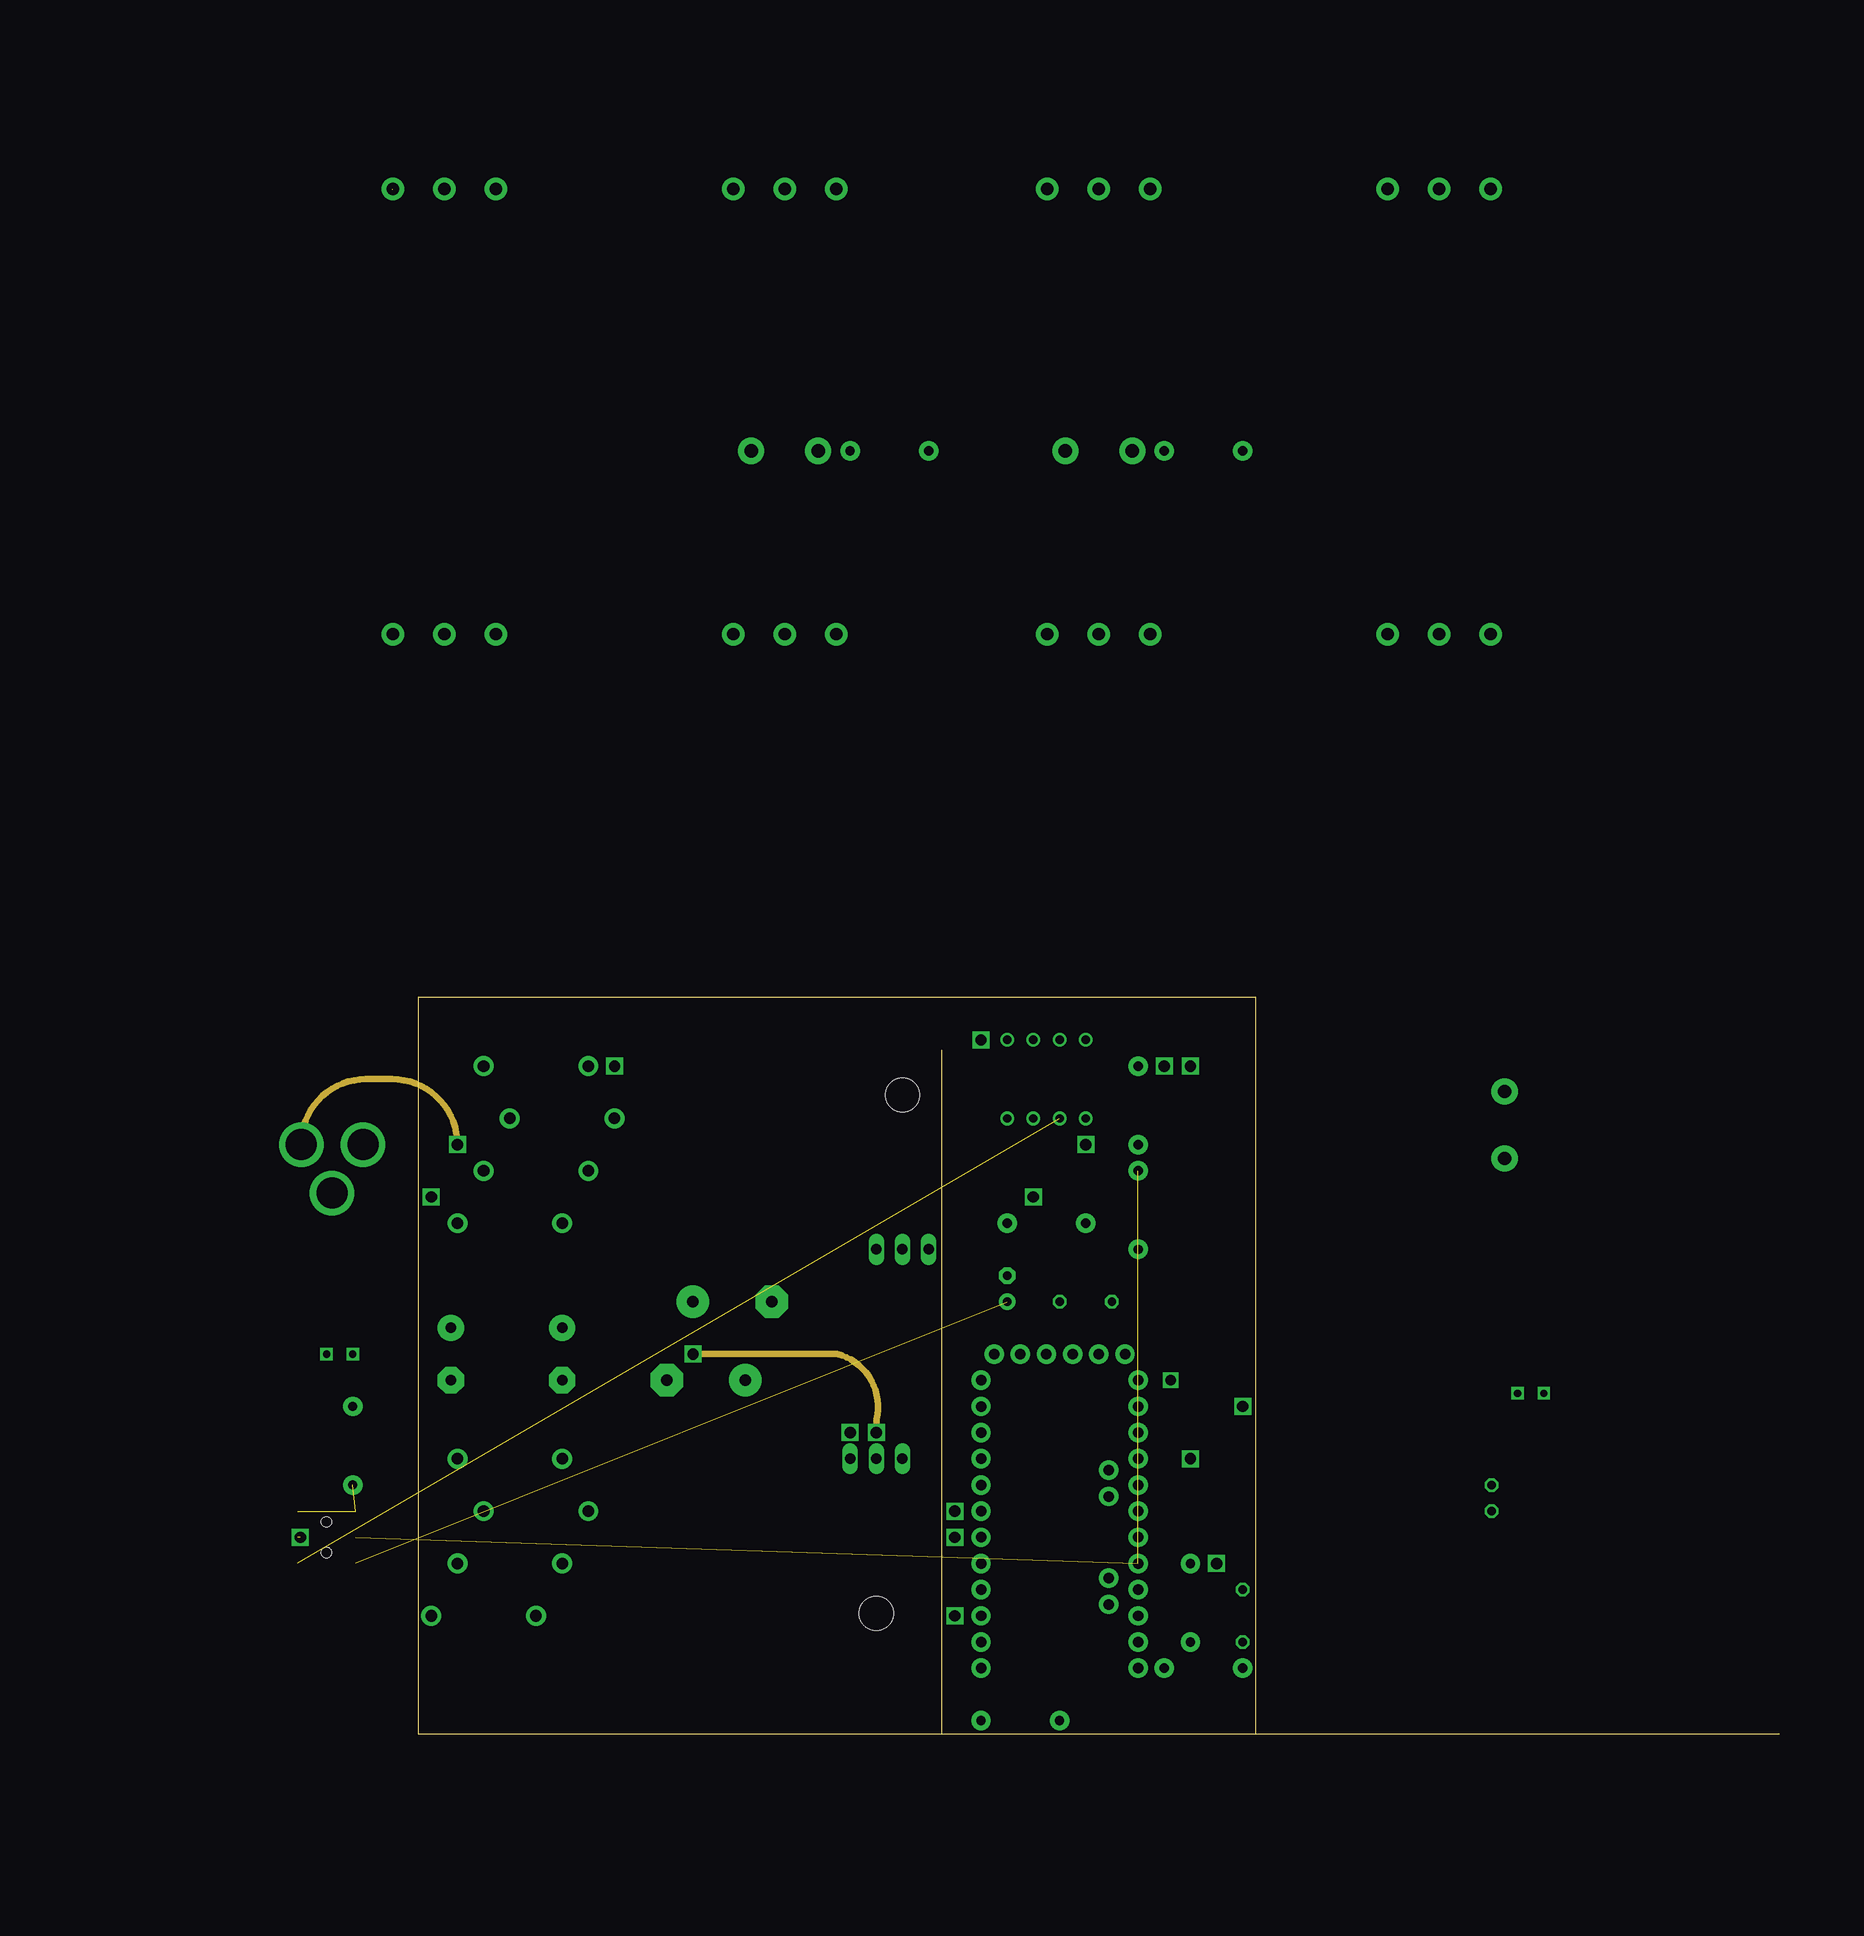
[diagram p6: board, inner layer OnBoardWire1]
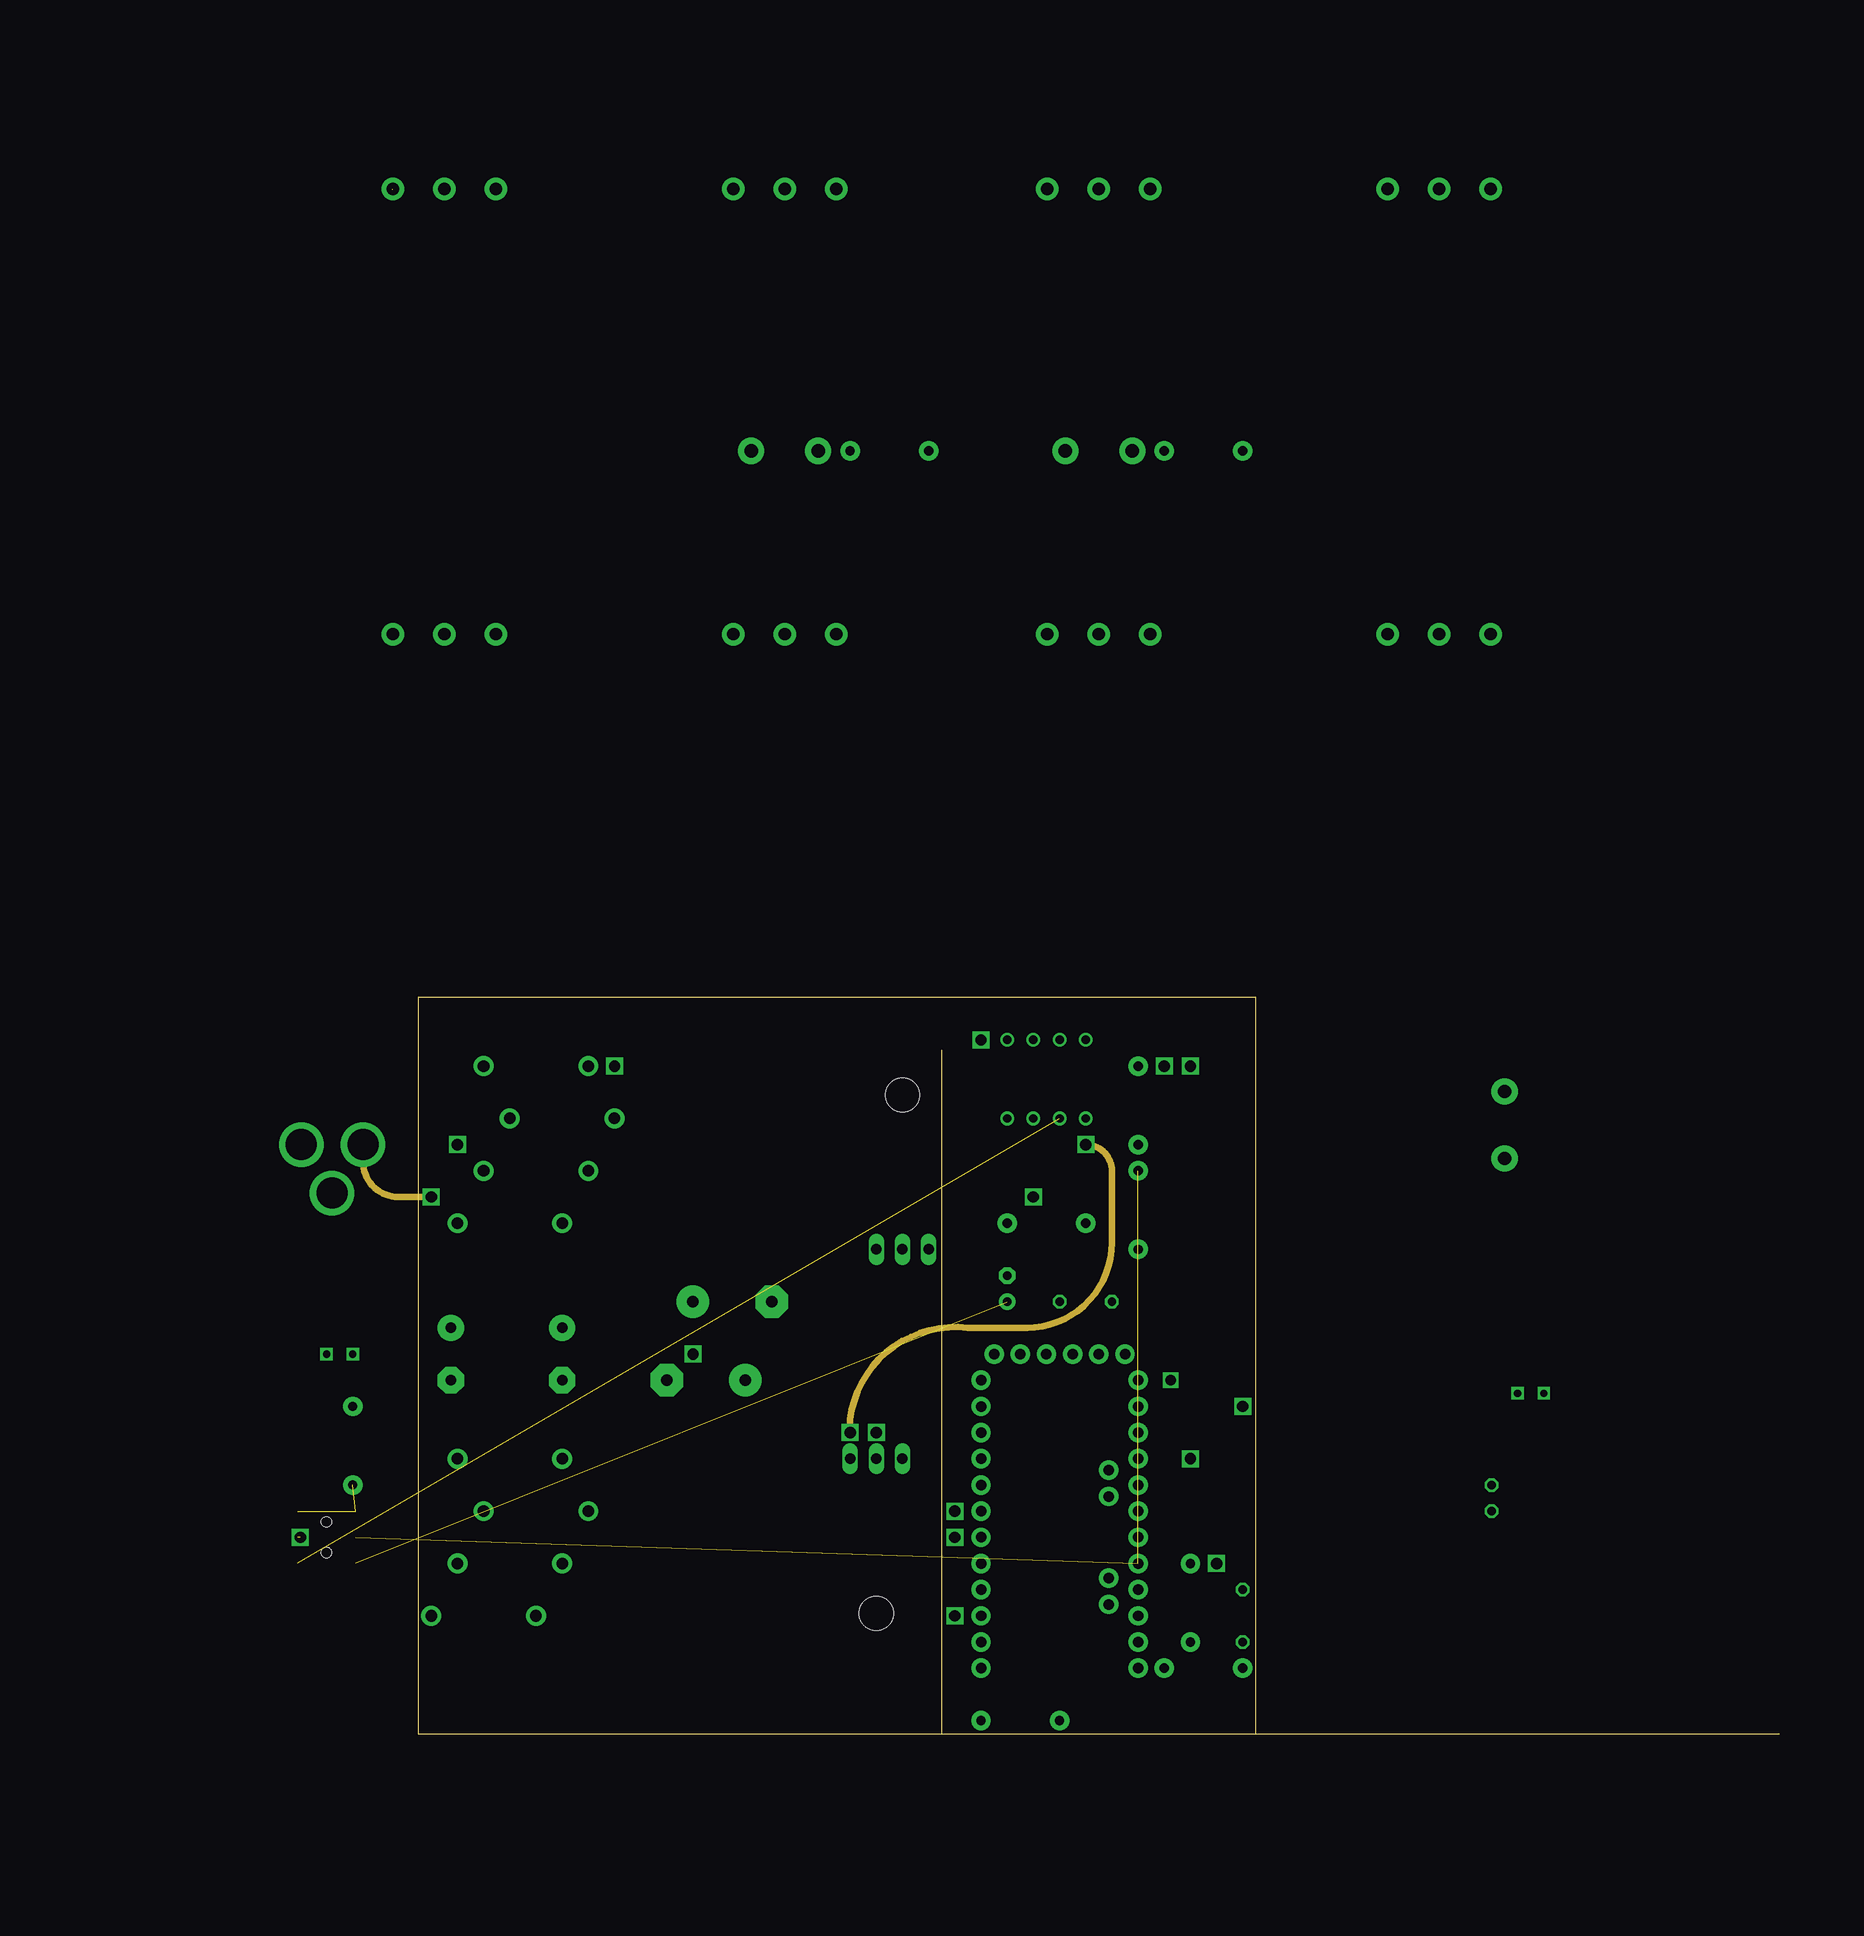
[diagram p7: board, inner layer OnBoardWire2]
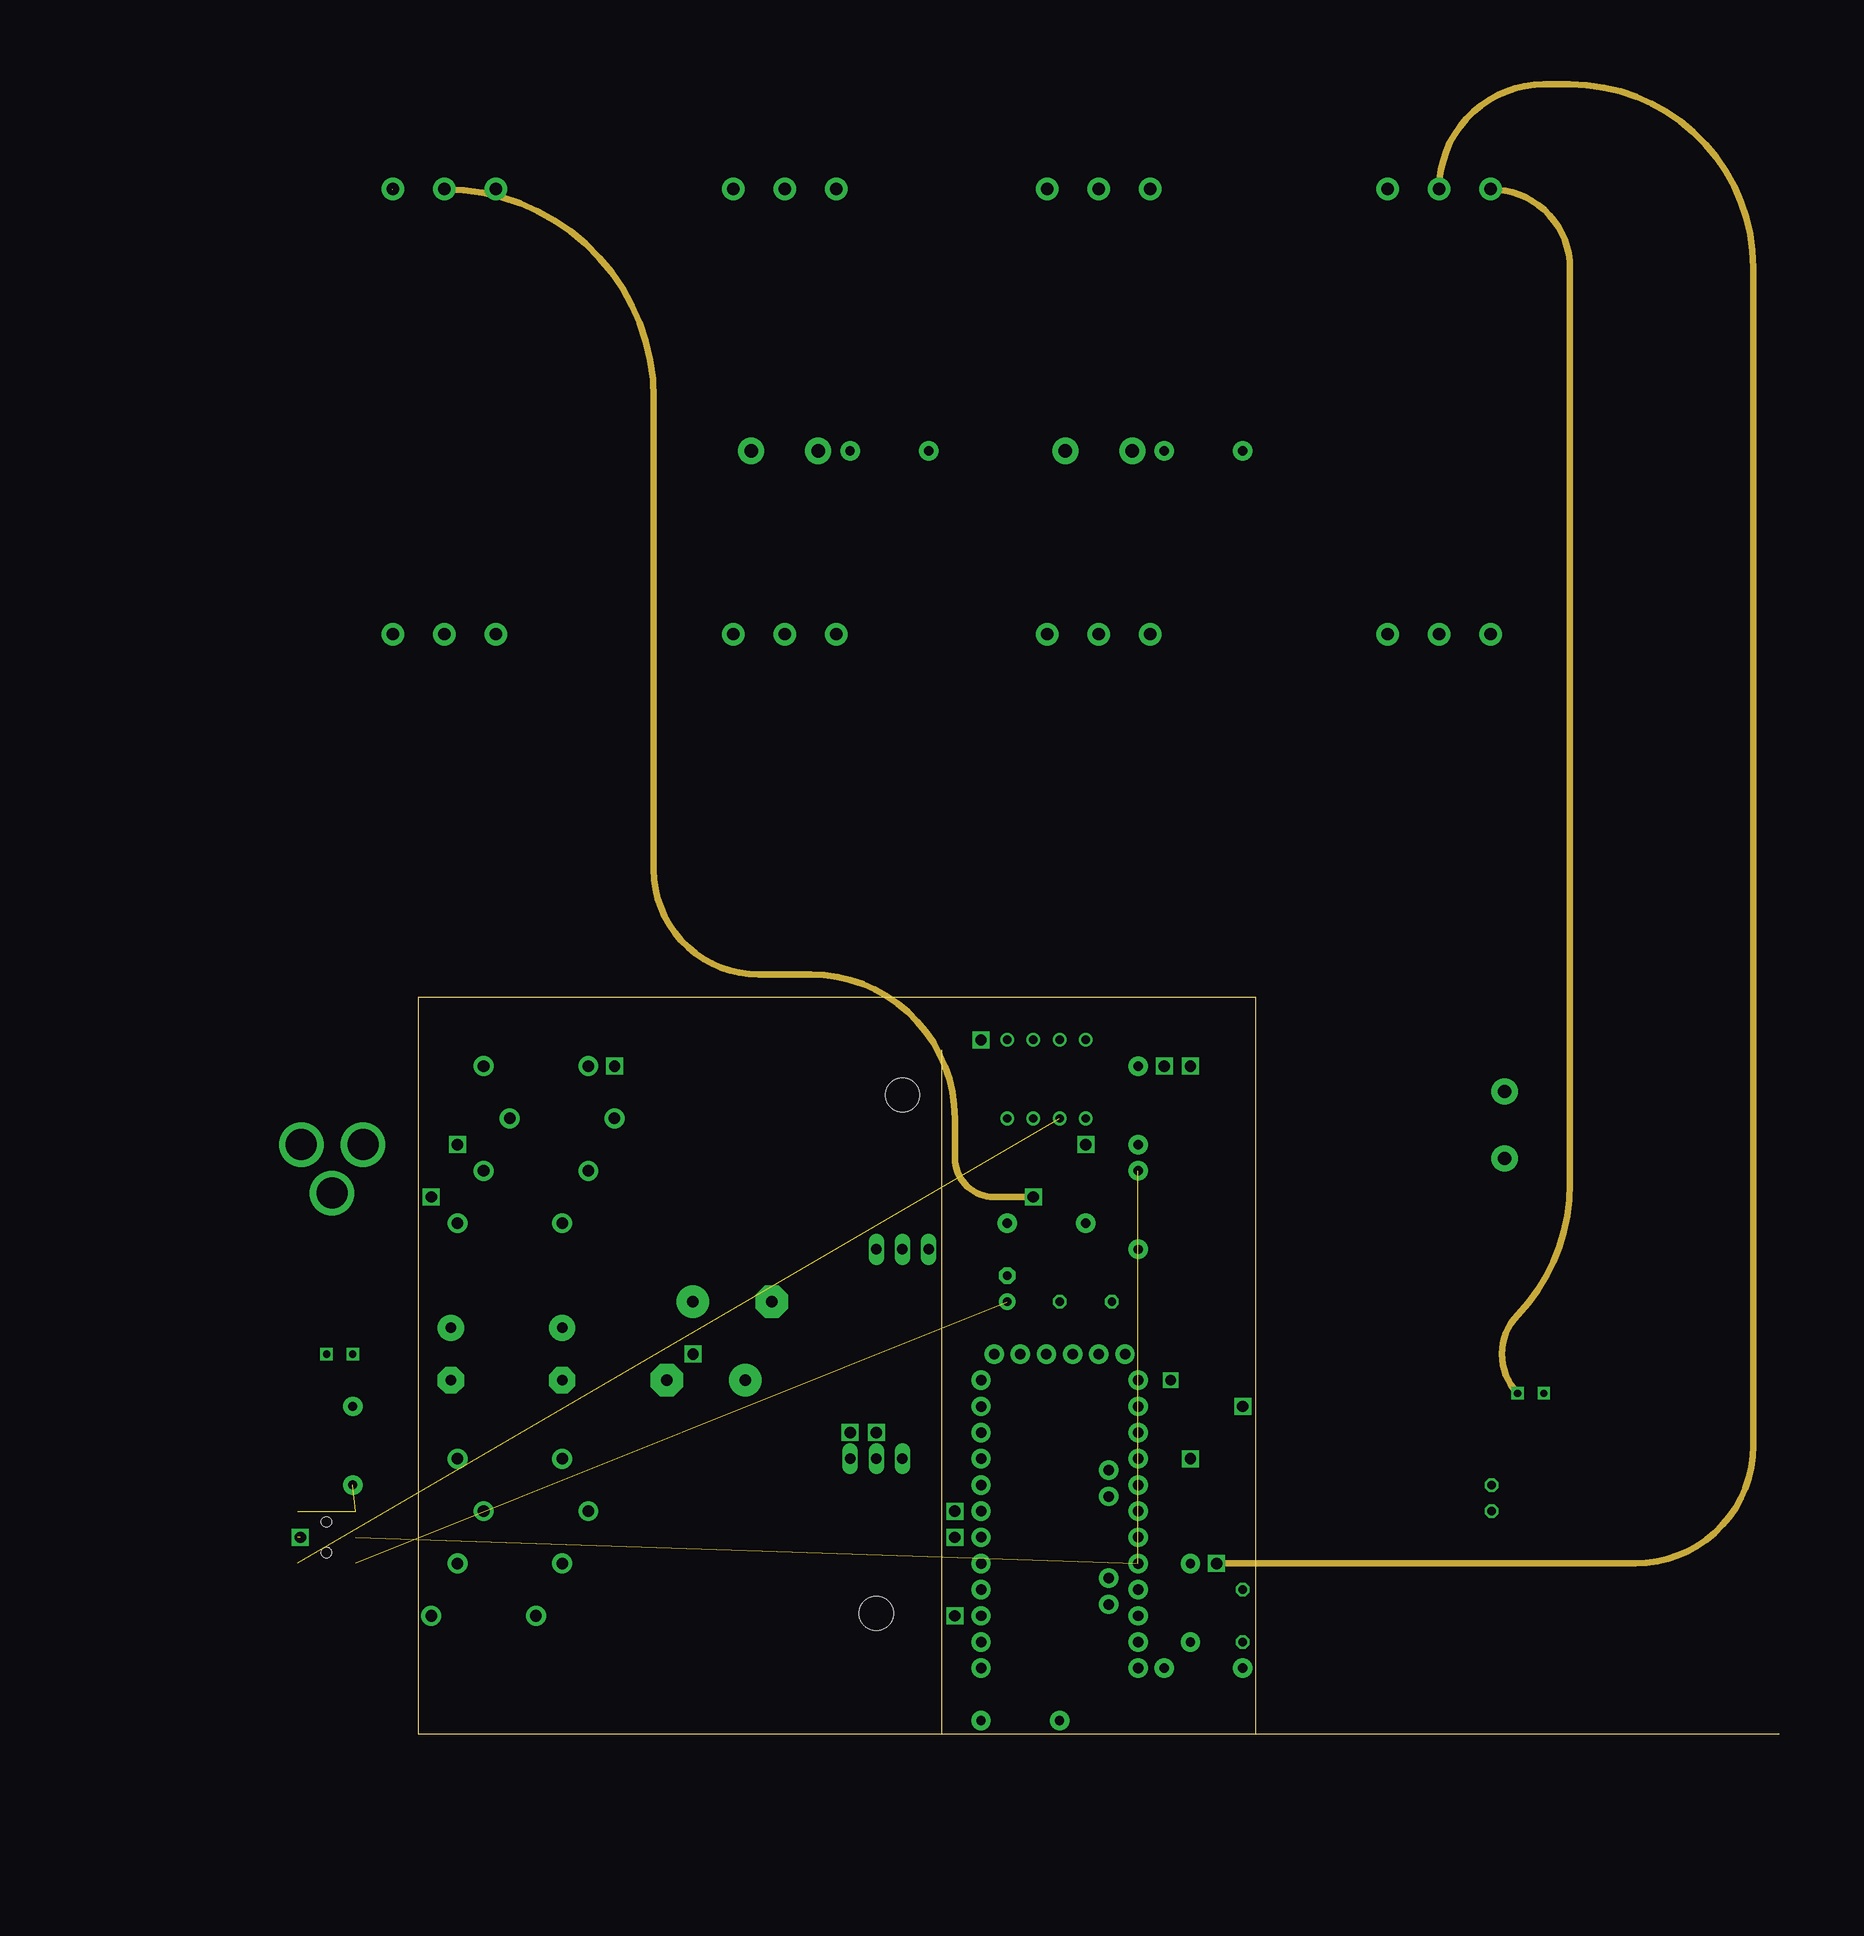
[diagram p8: board, inner layer Audio]
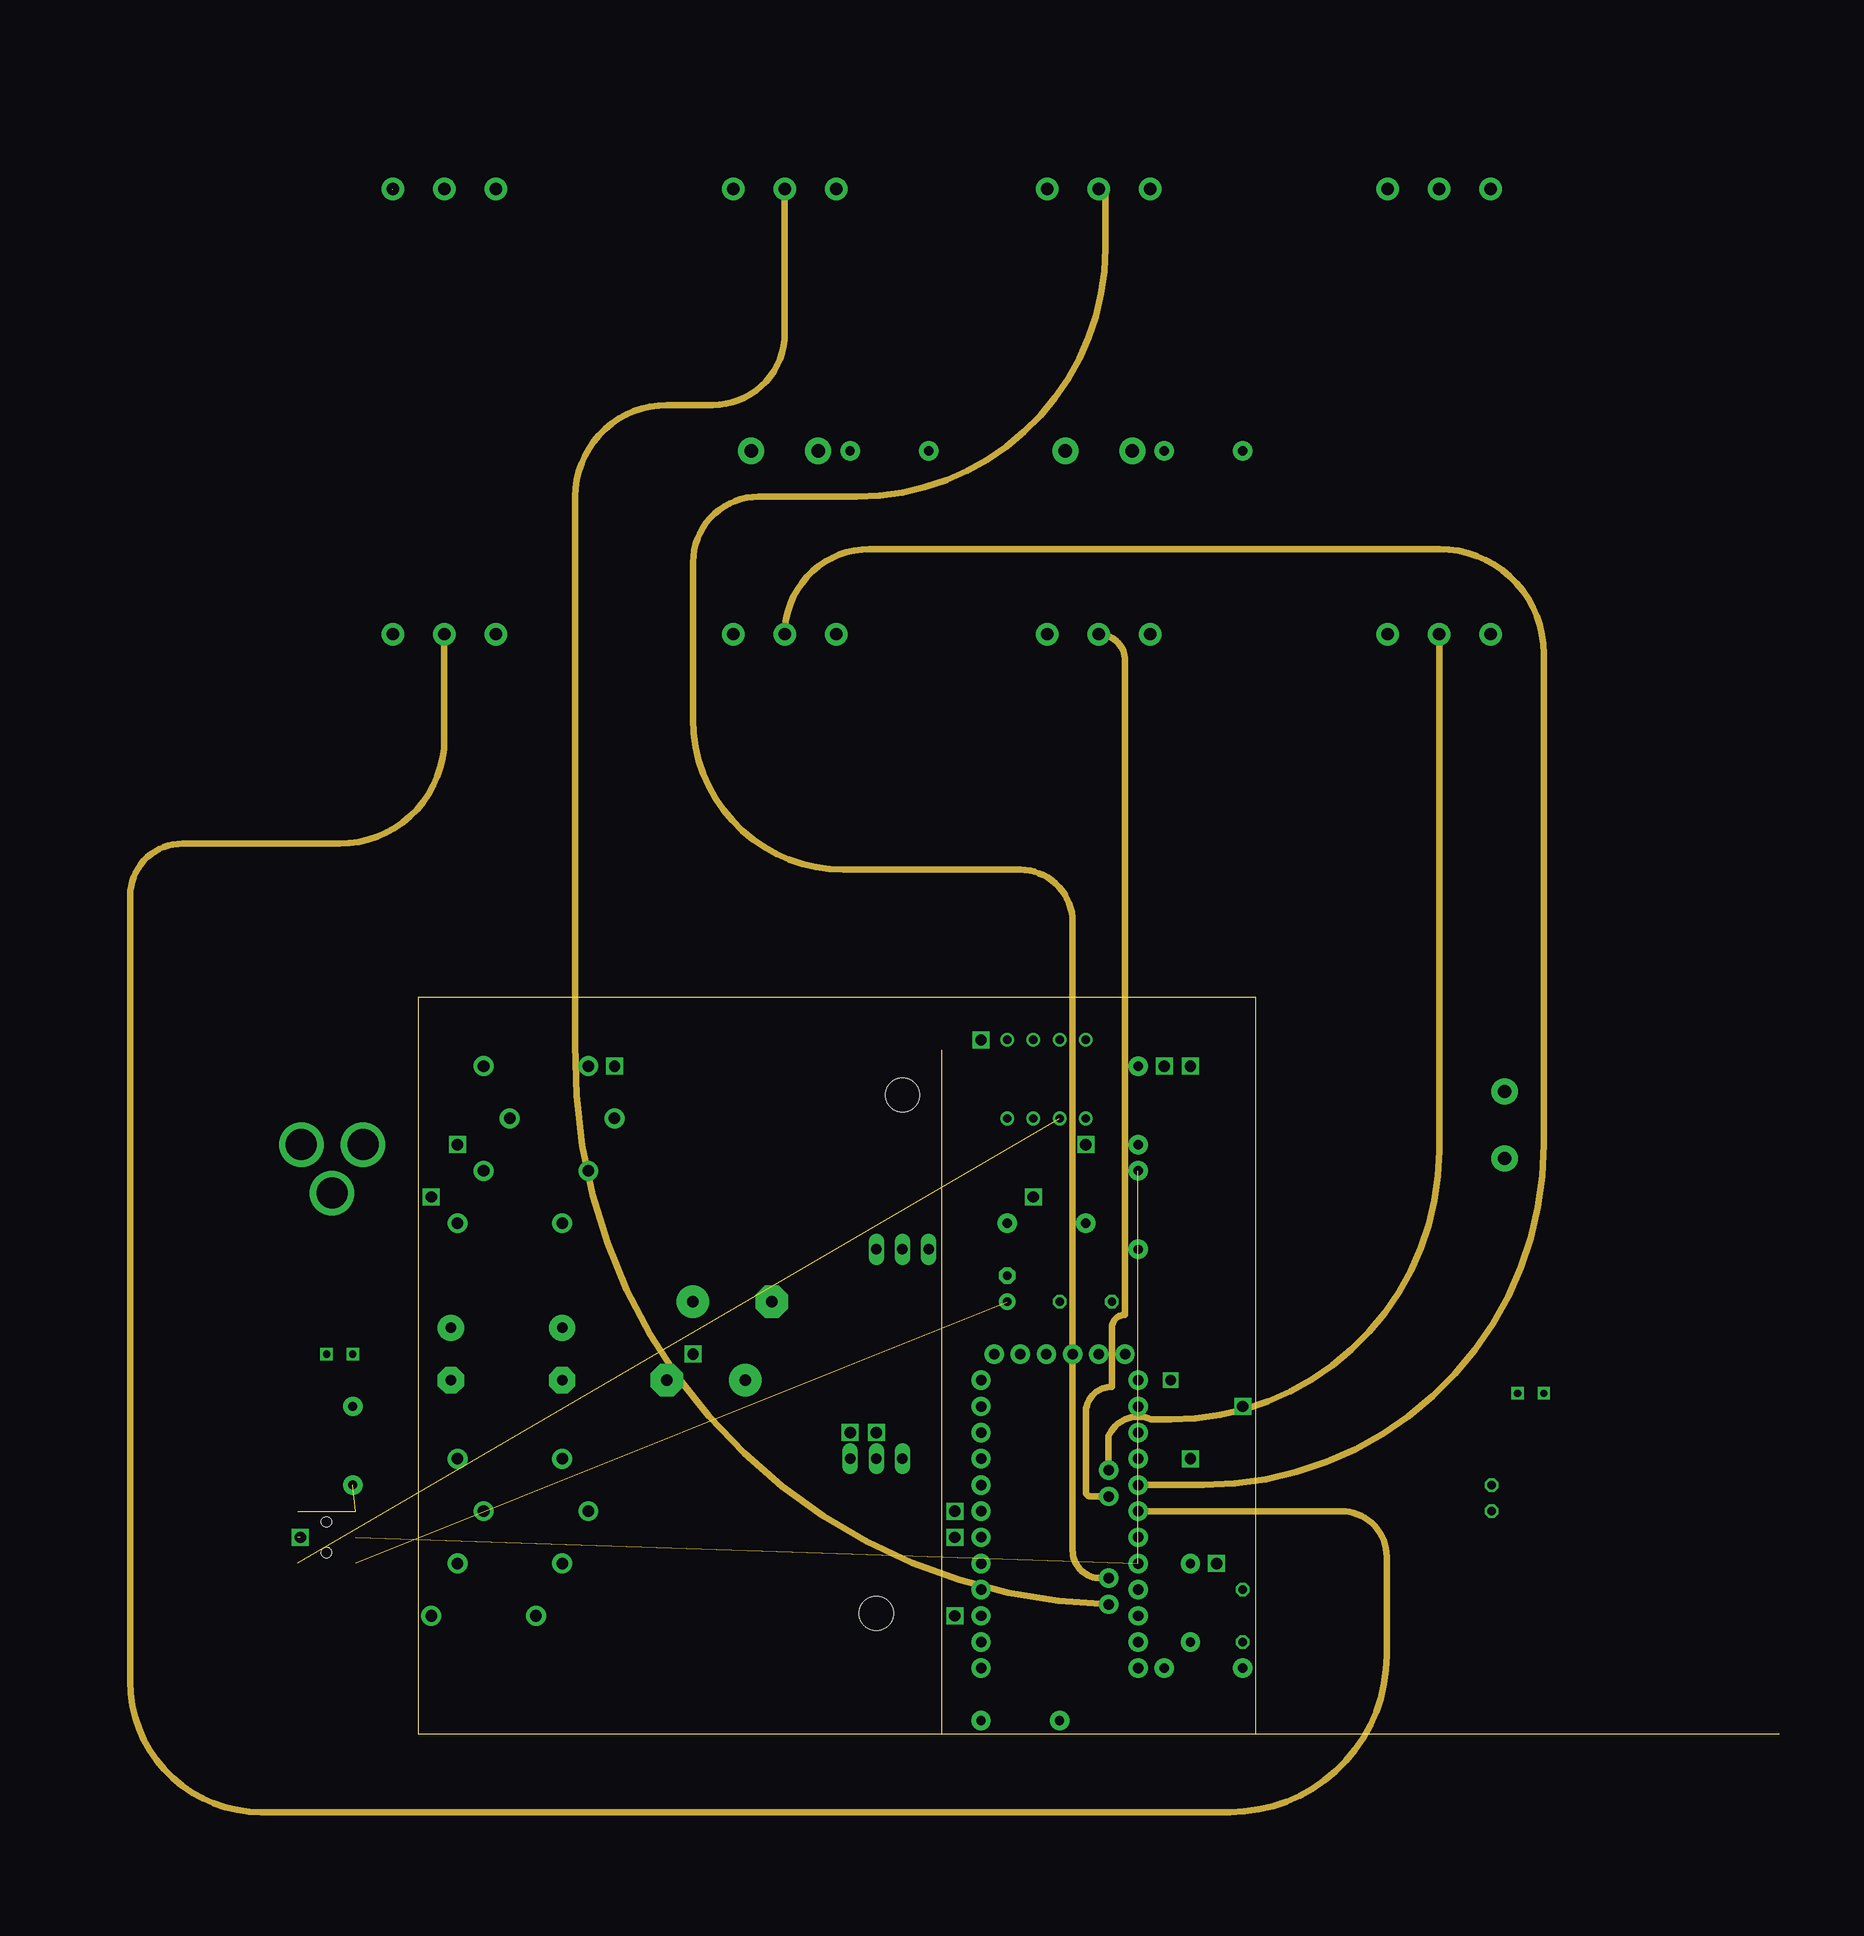
[diagram p9: board, inner layer Pots]
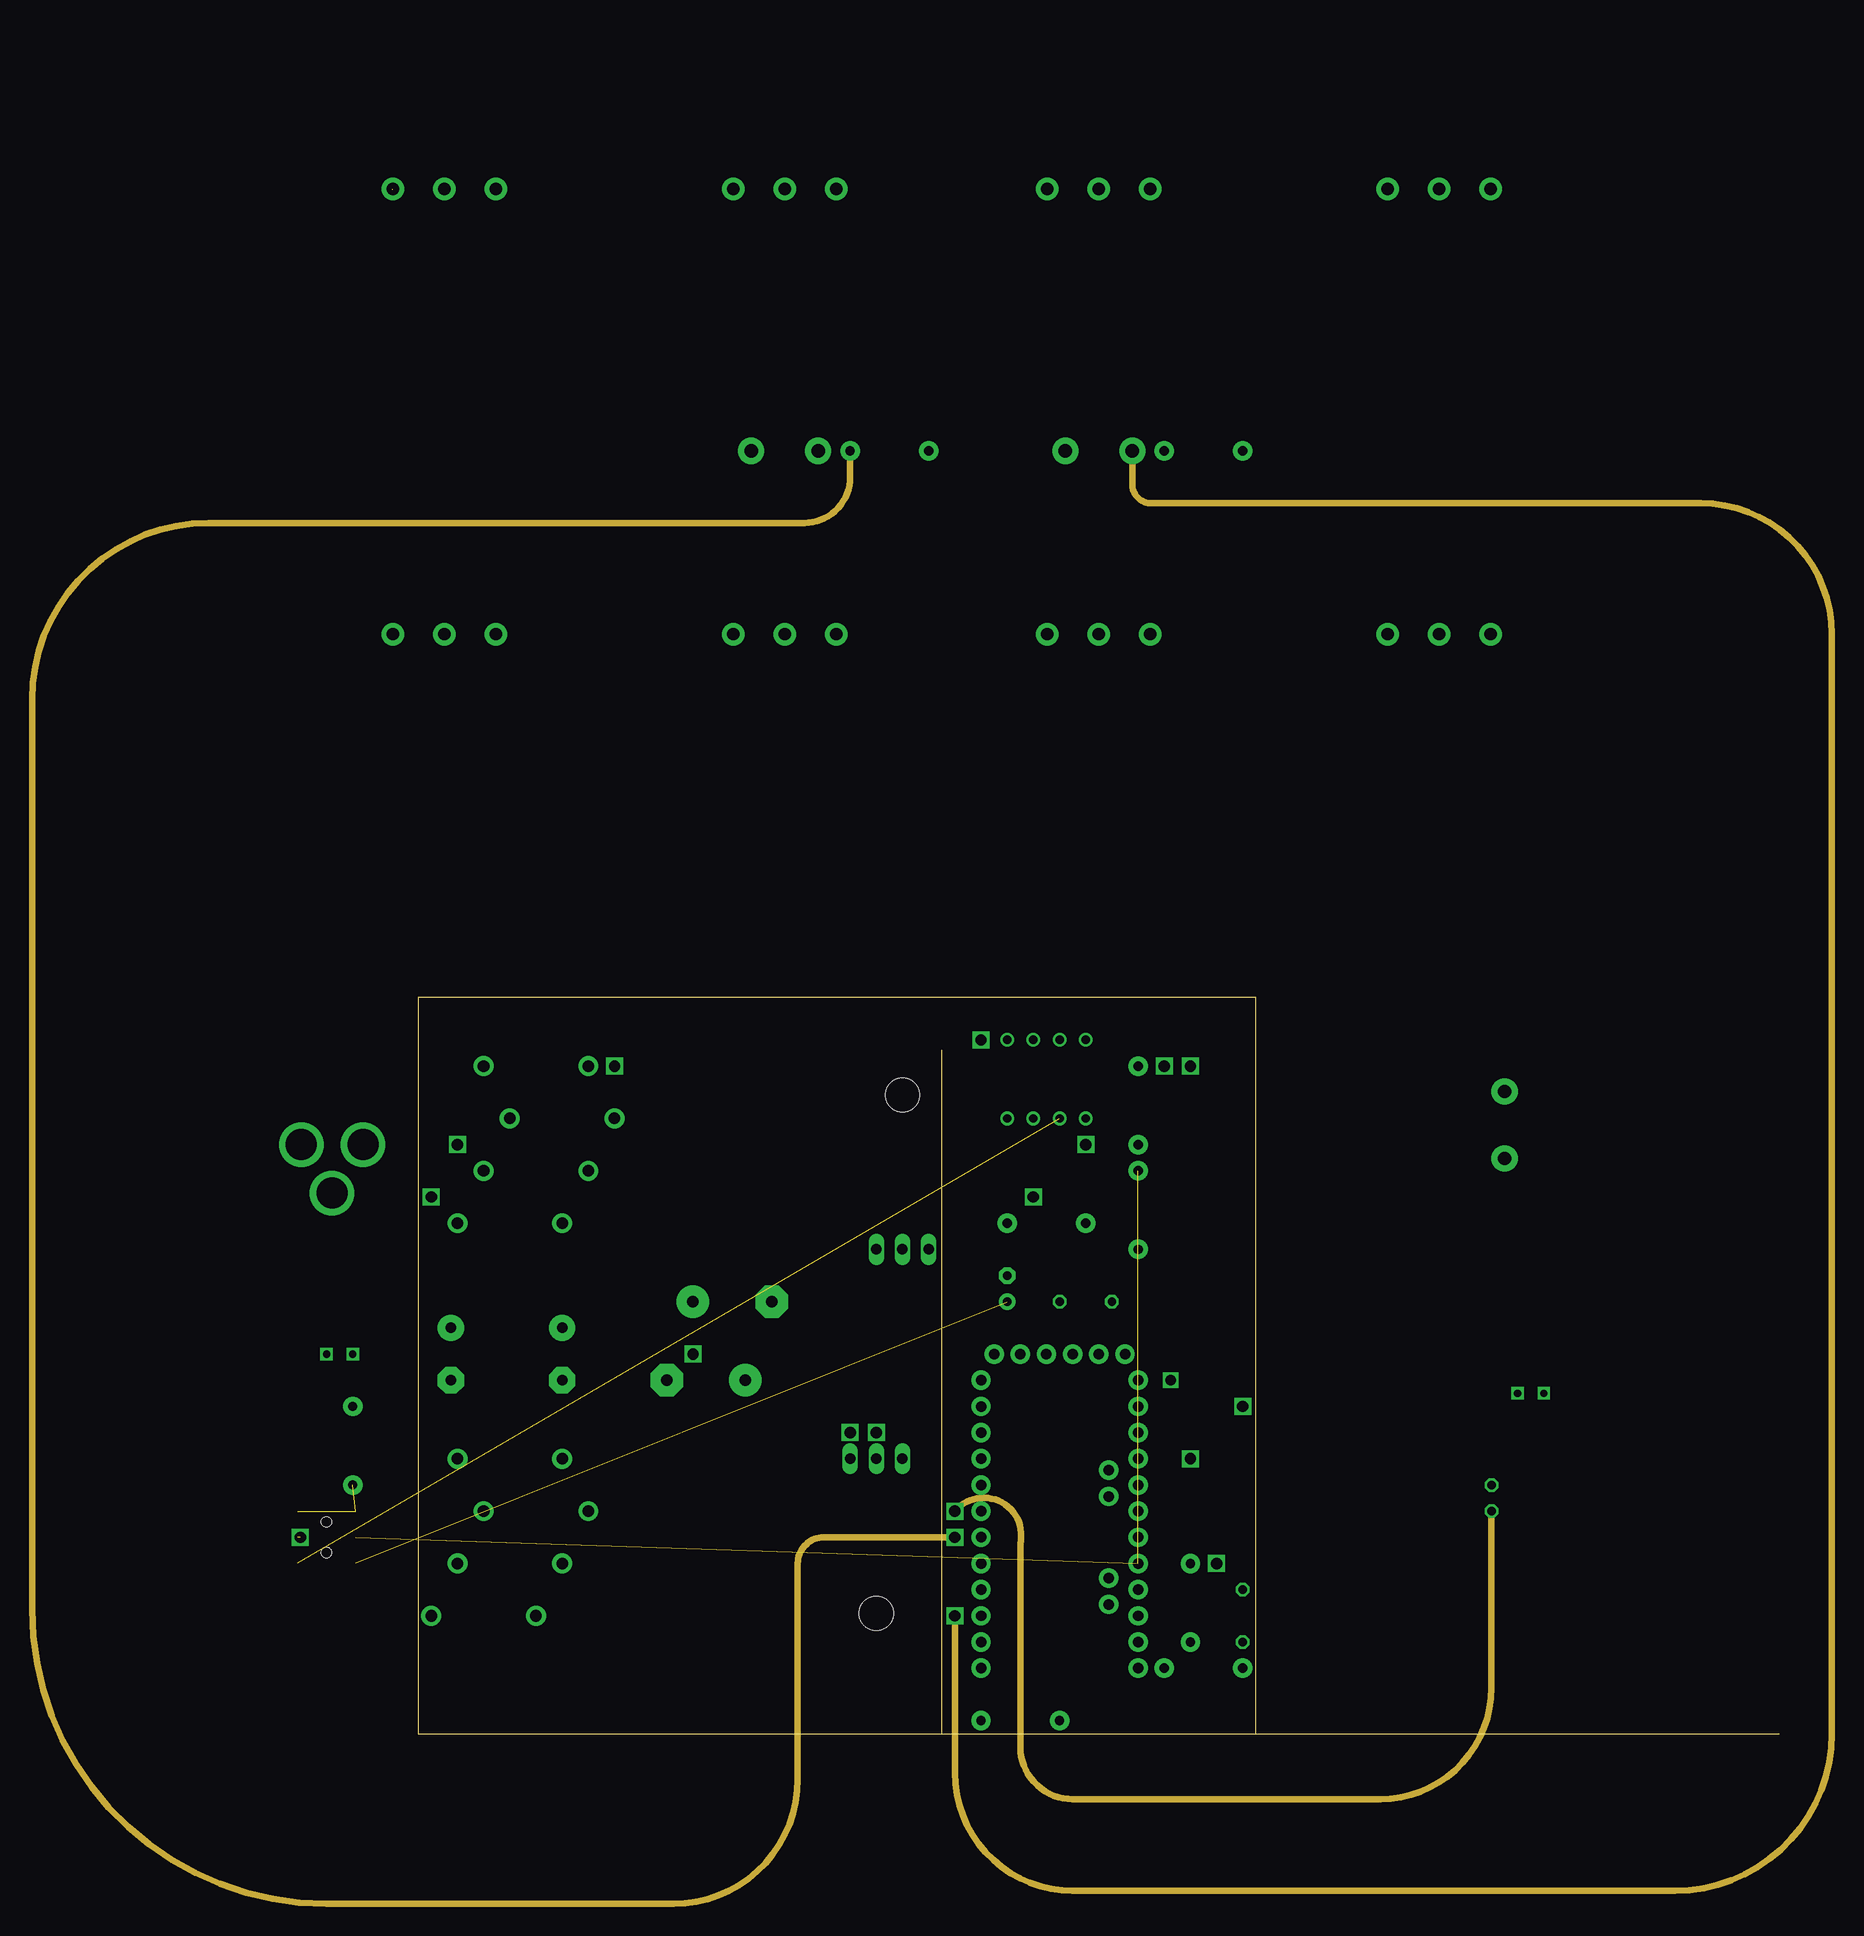
[diagram p10: board, inner layer Led&Switches]
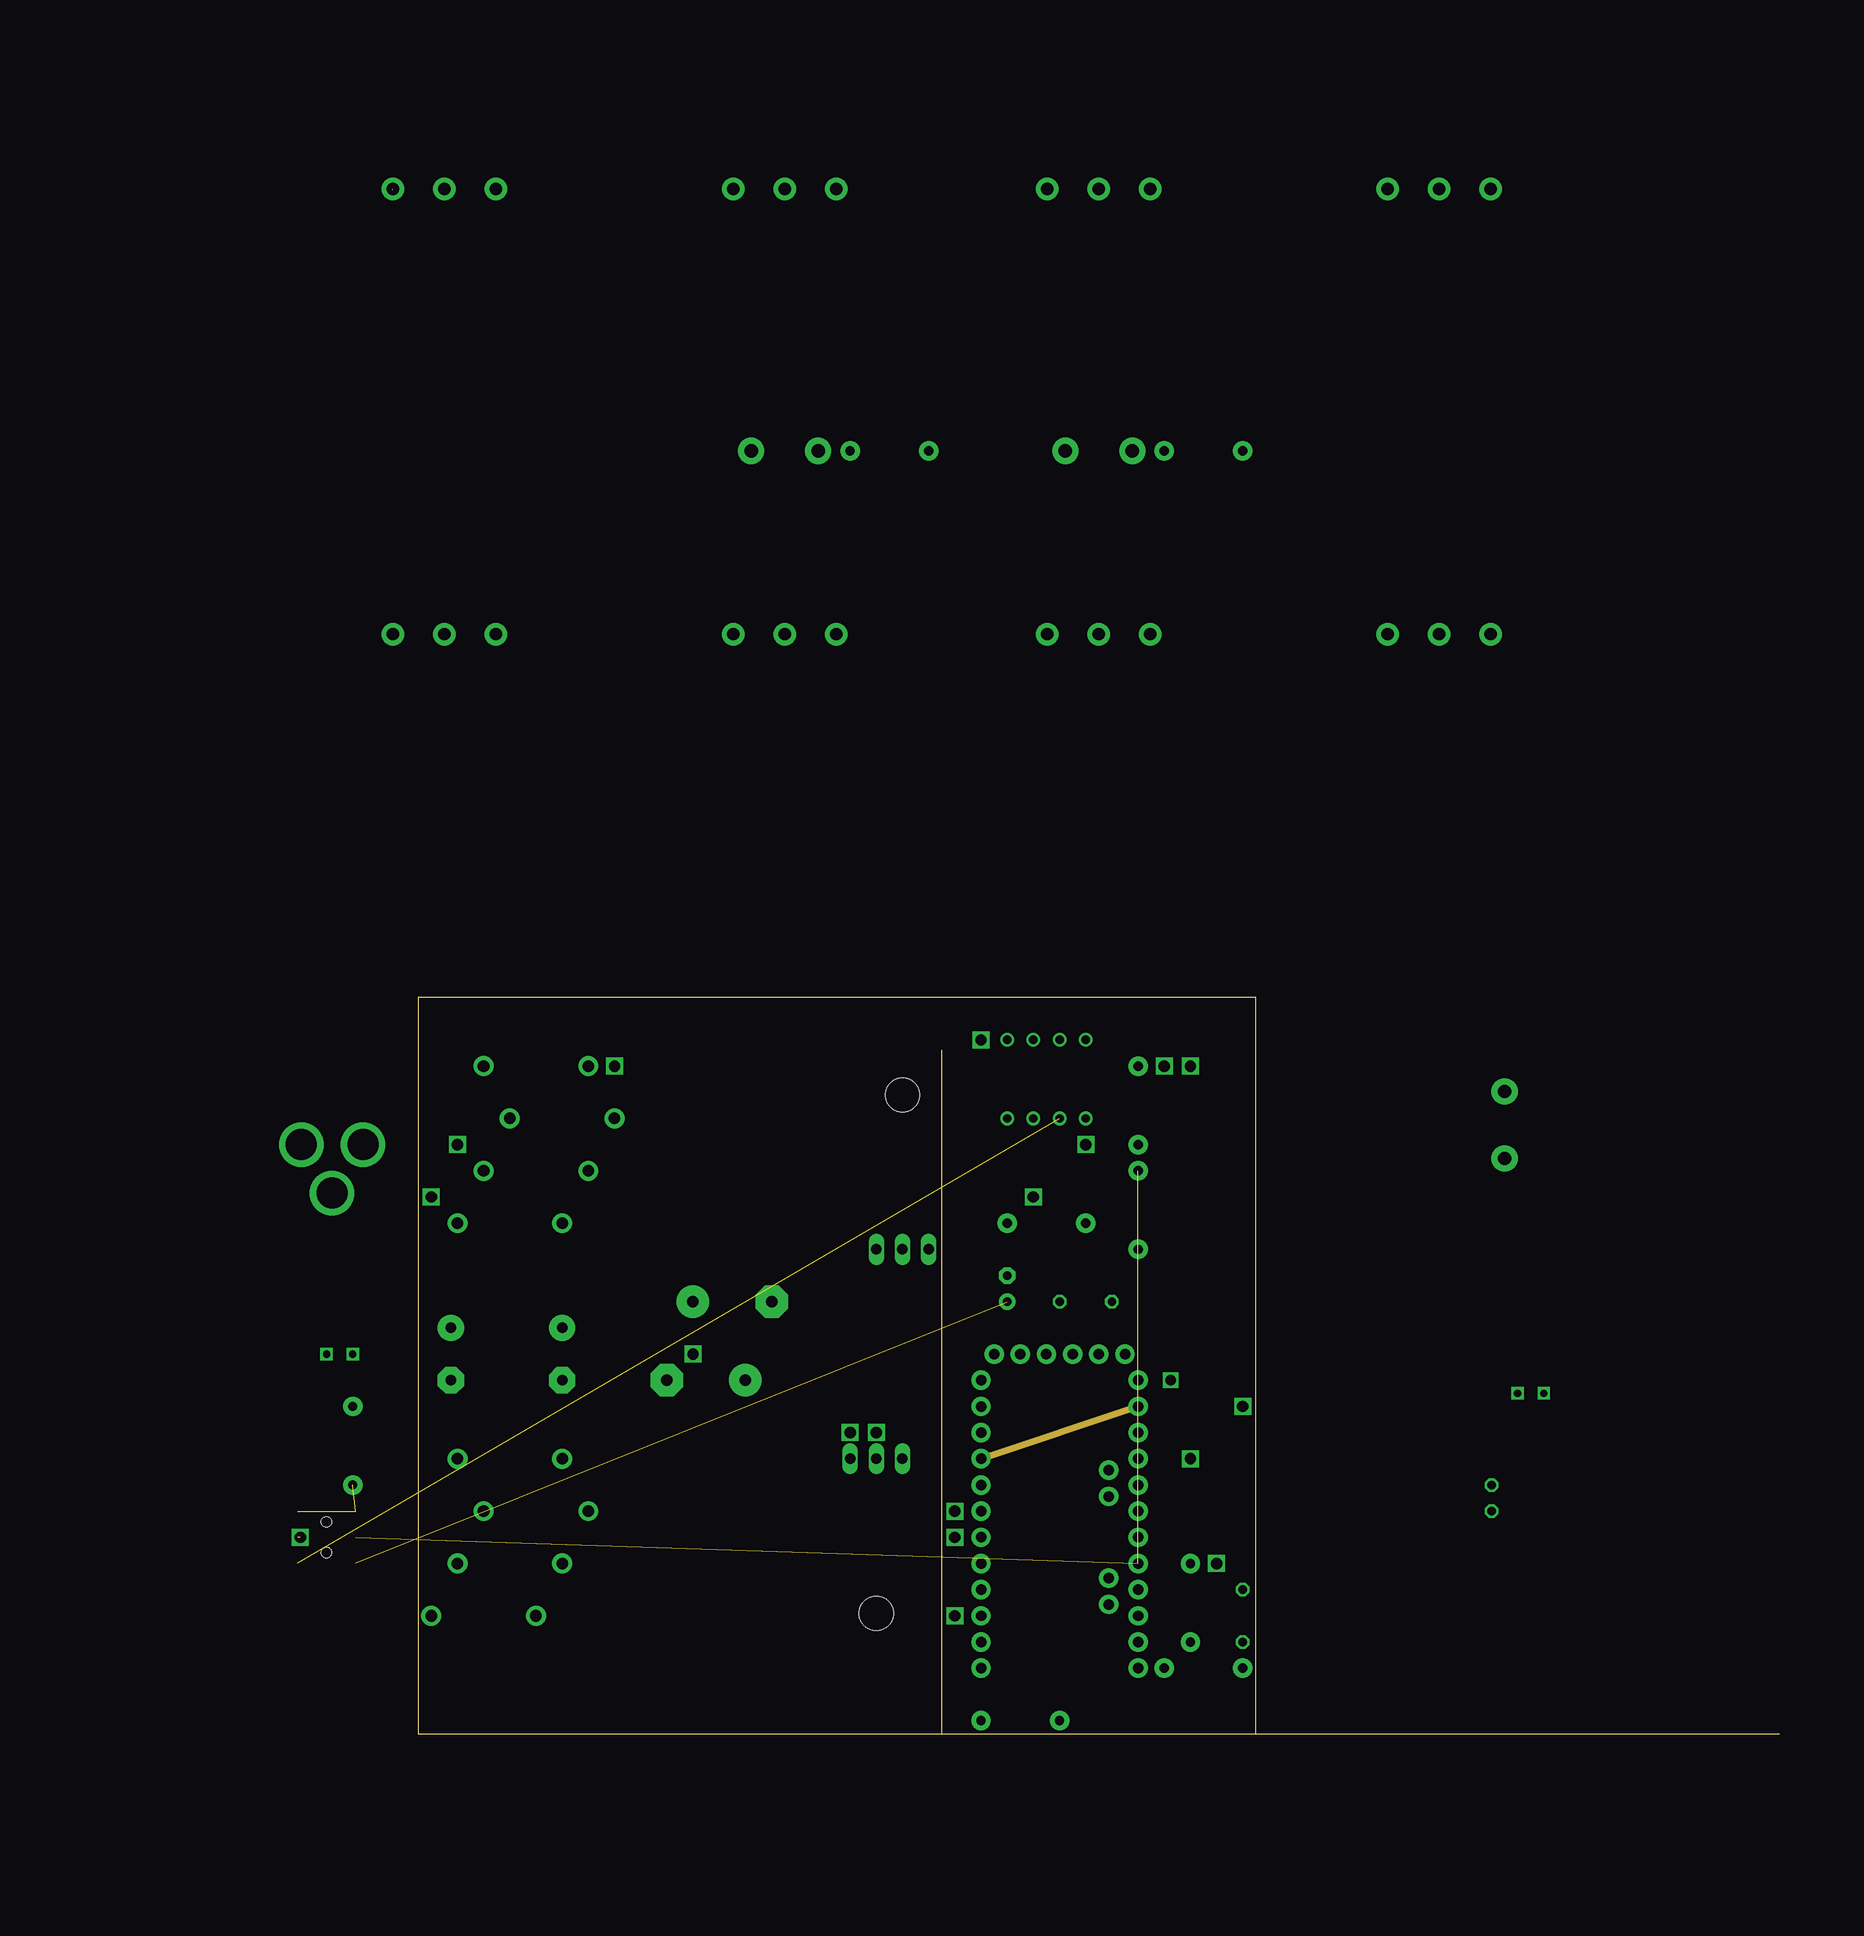
[diagram p11: board, inner layer DummyGND]
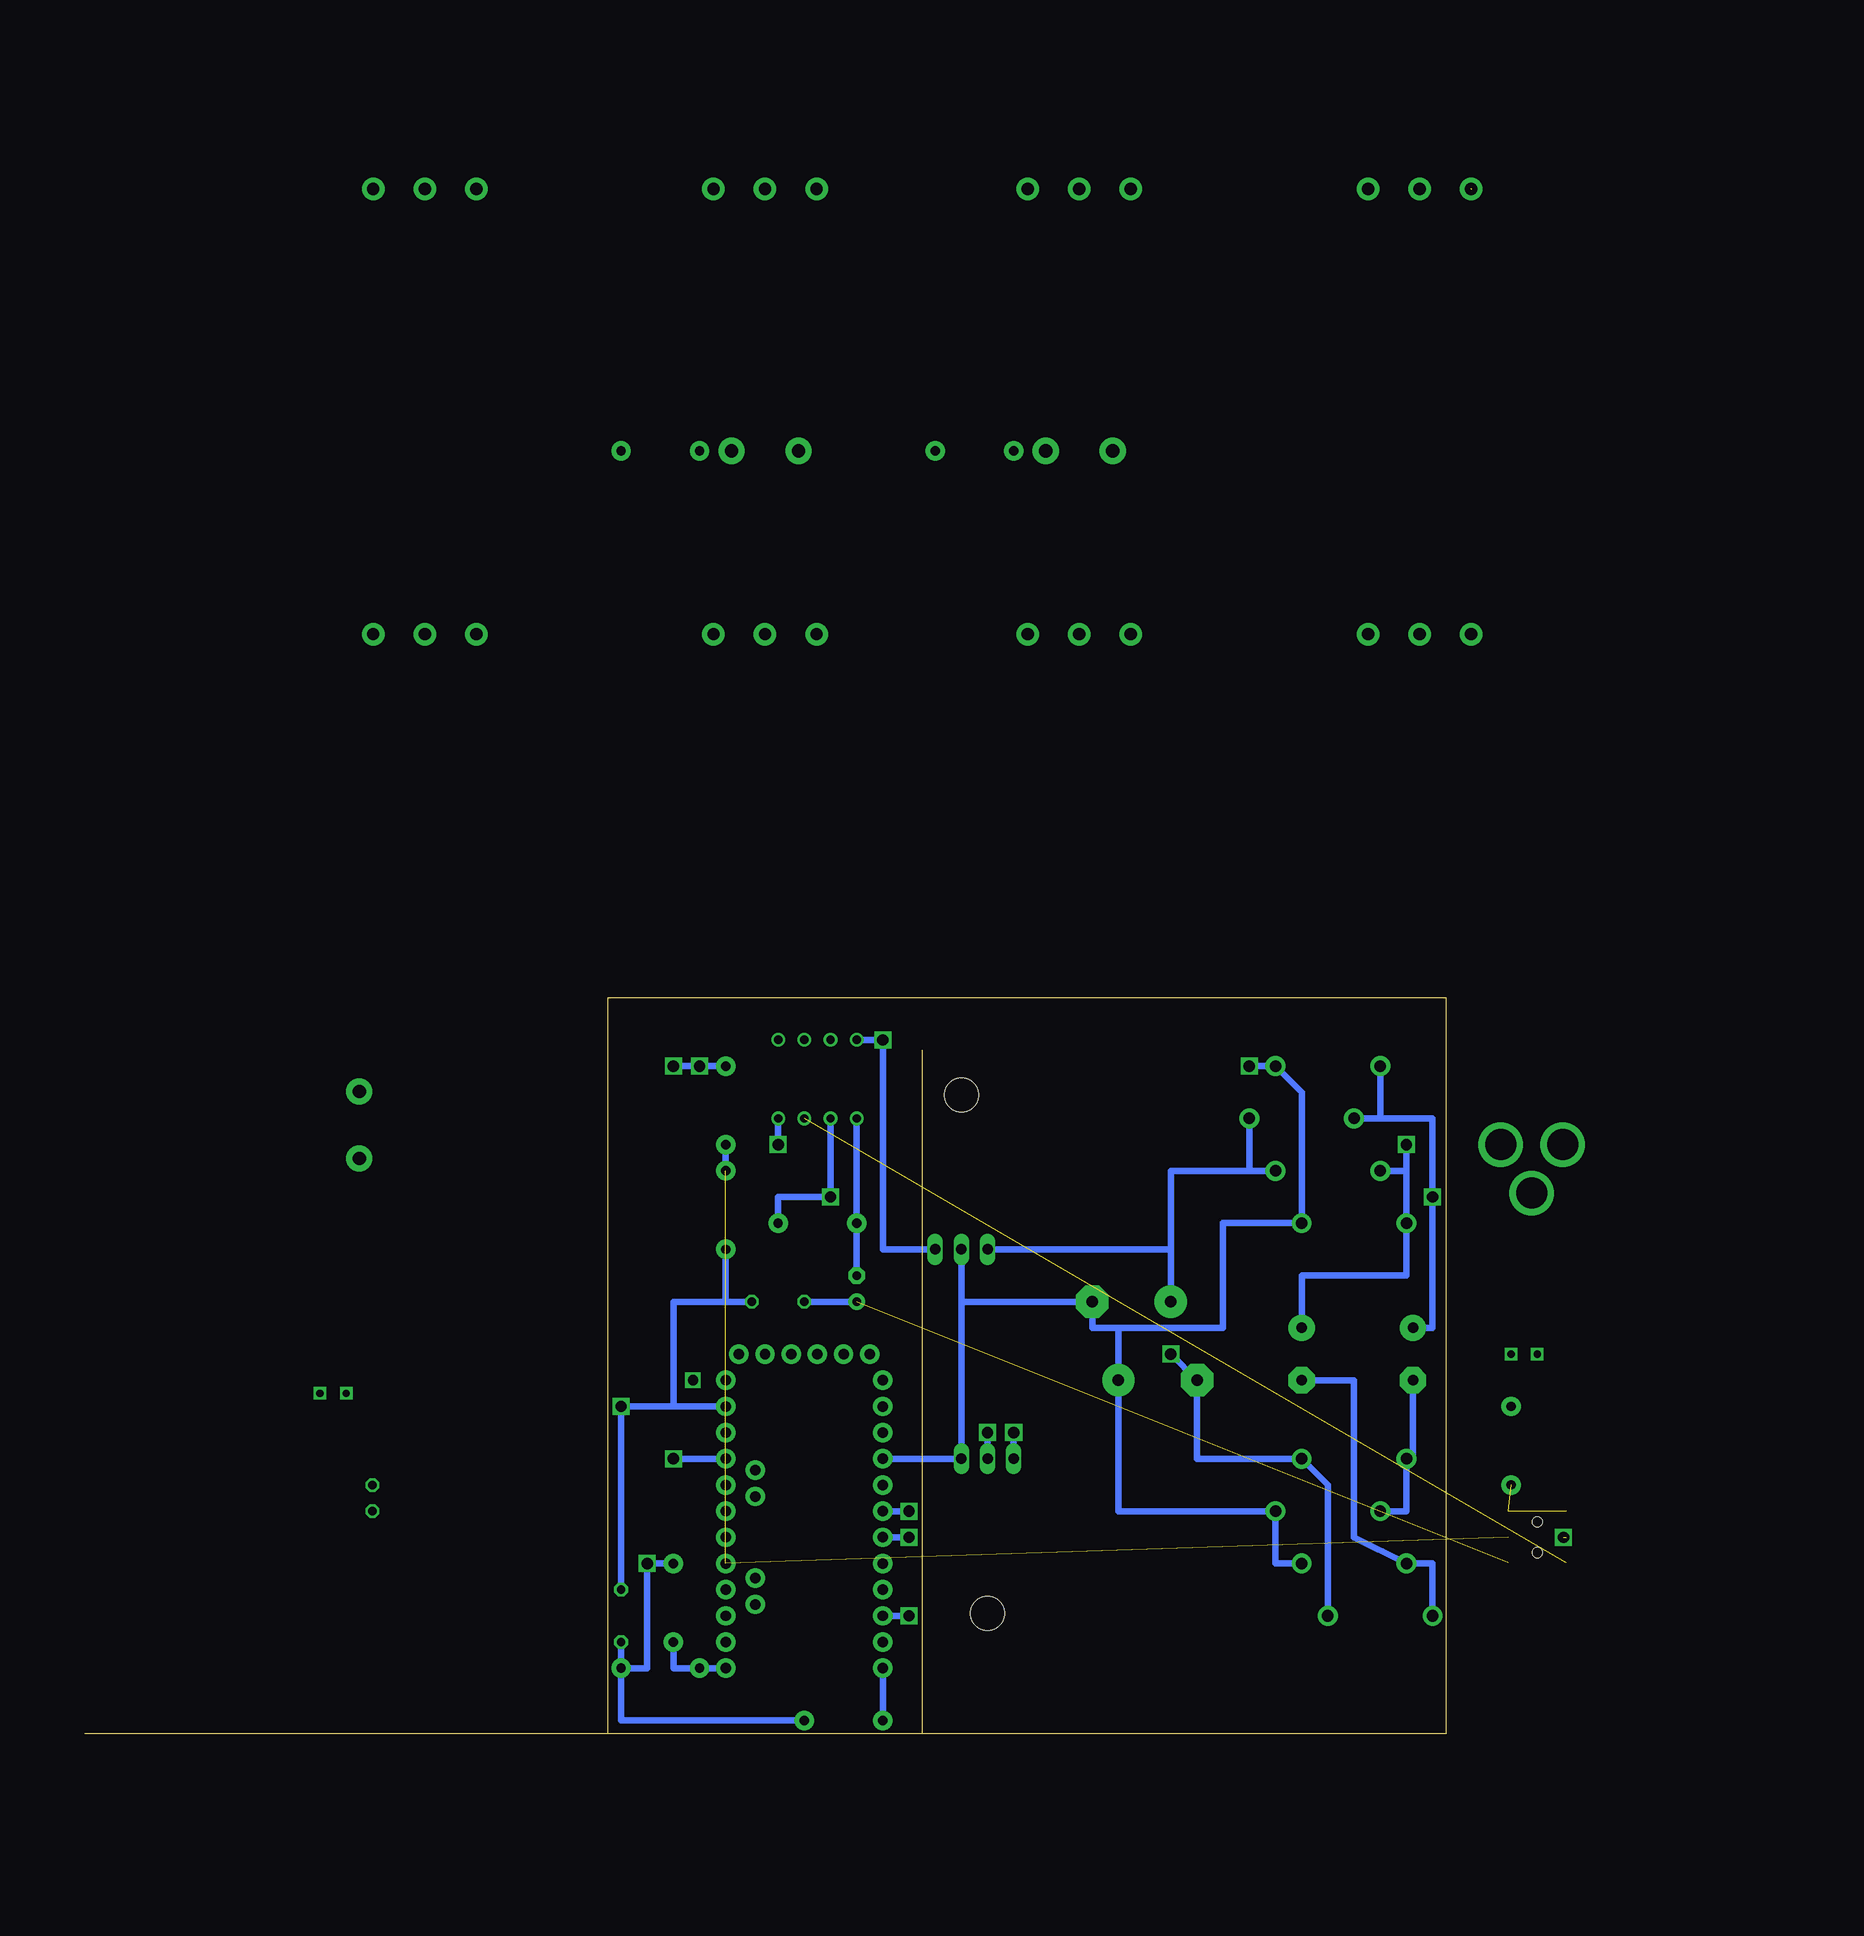
[diagram p12: board, bottom side, seen from below]

Size 132.06 x 71.42 mm. Coordinates in mm from the lower left corner, seen from the top.
Outline: 132.06,0 50.8,0 50.8,66.34
Outline: 0,0 81.26,0 81.26,71.42 0,71.42 0,0
Copper layers (1+2+3+4+5+6+7+8+9+10+11+12+13+14+15+16): Top 0.035mm / dielectric 1.5mm / Ground 0.035mm / dielectric 0.15mm / 5V 0.035mm / dielectric 0.2mm / Component2Component 0.035mm / dielectric 0.15mm / +9V 0.035mm / dielectric 0.2mm / OnBoardWire1 0.035mm / dielectric 0.15mm / OnBoardWire2 0.035mm / dielectric 0.2mm / Audio 0.035mm / dielectric 0.15mm / Pots 0.035mm / dielectric 0.2mm / Led&Switches 0.035mm / dielectric 0.15mm / Route11 0.035mm / dielectric 0.2mm / Route12 0.035mm / dielectric 0.15mm / Route13 0.035mm / dielectric 0.2mm / Route14 0.035mm / dielectric 0.15mm / DummyGND 0.035mm / dielectric 0.2mm / Bottom 0.035mm
Design rules "default *": minimum track width 10mil, minimum drill 24mil, track to track 8mil, track to pad 8mil, pad to pad 8mil, via to via 8mil, smd to smd 8mil, copper to edge 40mil, drill to drill 8mil, minimum pad ring 10mil, minimum via ring 8mil, stop-mask expansion 4mil, vias tented up to drill 0mil, thermal gap 10mil

### Footprints (pad centres in the part's own frame; a part is rotated, then mirrored left to right if it is on the bottom)
ARDUINO_PRO_MINI = drill 1.016 pad 1.88: 1 -7.62,12.7; 2 -7.62,10.16; 3 -7.62,7.62; 4 -7.62,5.08; 5 -7.62,2.54; 6 -7.62,0; 7 -7.62,-2.54; 8 -7.62,-5.08; 9 -7.62,-7.62; 10 -7.62,-10.16; 11 -7.62,-12.7; 12 -7.62,-15.24; 13 7.62,-15.24; 14 7.62,-12.7; 15 7.62,-10.16; 16 7.62,-7.62; 17 7.62,-5.08; 18 7.62,-2.54; 19 7.62,0; 20 7.62,2.54; 21 7.62,5.08; 22 7.62,7.62; 23 7.62,10.16; 24 7.62,12.7; A4 4.763,1.429; A5 4.763,3.969; A6 4.763,-9.049; A7 4.763,-6.509; BLK -6.35,15.24; GND -3.81,15.24; GRN 6.35,15.24; RXI 1.27,15.24; TXO 3.81,15.24; VCC -1.27,15.24
C050-025X075 = drill 0.813 octagon: 1 -2.54,0; 2 2.54,0
E30-16 = drill 1.118 pad 3.15: + -19.05,6.35 | drill 1.118 pad 3.15 octagon: - -19.05,-1.27
E35-16 = drill 1.118 pad 3.15: + -16.51,3.81 | drill 1.118 pad 3.15 octagon: - -16.51,-3.81
E5-10,5 = drill 1.016 pad 2.54: + -2.54,0 | drill 1.016 pad 2.54 octagon: - 2.54,0
E2,5-6 = drill 0.813 pad 1.6: + -1.27,0 | drill 0.813 pad 1.6 octagon: - 1.27,0
DO41-10 = drill 1.118 pad 1.93: A 5.08,0; C -5.08,0
79XXL = drill 1.016 long: GND -2.54,-3.81; IN 0,-3.81; OUT 2.54,-3.81 | hole 3.302: 0,11.176
78XXL = drill 1.016 long: GND 0,-3.81; IN -2.54,-3.81; OUT 2.54,-3.81 | hole 3.302: 0,11.176
DIL08 = drill 0.813 pad 1.27: 1 -3.81,-3.81; 2 -1.27,-3.81; 3 1.27,-3.81; 4 3.81,-3.81; 5 3.81,3.81; 6 1.27,3.81; 7 -1.27,3.81; 8 -3.81,3.81
TWO_PADS = drill 0.7 square: SLEEVE -1.27,0; TIP 1.27,0
POWER_JACK_PTH = drill 2.997 pad 4.318: GND 0,7.7; GNDBREAK 4.7,10.7; PWR 0,13.7
LED3MM = drill 0.813 octagon: A -1.27,0; K 1.27,0
3RP/1610N = drill 1.2 pad 2.184: 1 -5,0; 2 0,0; 3 5,0
AXIAL-0.3 = drill 0.9 pad 1.88: P$1 -3.81,0; P$2 3.81,0
TACT_PANA-EVQ = drill 1.3 pad 2.54: P$1 -3.25,0; P$2 3.25,0
EG1390 = smd 1 x 1.5: O1 -2.5,2.8; O2 -2.5,-2.8; P1 0,2.8; P2 0,-2.8; S1 2.5,2.8; S2 2.5,-2.8 | hole 1: 1.5,0; -1.5,0

### Placement (x,y rotation side)
B1  62.23,21.59 0 top
C1  80.01,11.43 90 top
C2  33.02,60.96 90 top
C3  27.94,17.78 270 top
C4  13.97,36.83 270 top
C5  3.17,36.83 270 top
C6  64.77,41.91 0 top
C7  57.15,43.18 90 top
D1  11.43,64.77 0 top
D2  13.97,59.69 180 top
D3  11.43,54.61 180 top
D4  8.89,49.53 0 top
D5  8.89,26.67 0 top
D6  11.43,21.59 180 top
D7  8.89,16.51 180 top
D8  6.35,11.43 0 top
IC1  44.45,22.86 180 top
IC2  46.99,50.8 0 top
IC3  60.96,63.5 0 top
JIN  -7.62,36.83 180 top  (outside the outline)
JOUT  107.95,33.02 180 top
JPWR  -19.05,57.15 270 top  (outside the outline)
LED1  104.14,22.86 90 top
P1  2.54,106.68 0 top  (outside the outline)
P2  35.56,106.68 0 top  (outside the outline)
P3  66.04,106.68 0 top  (outside the outline)
P4  99.06,106.68 0 top  (outside the outline)
P5  35.56,149.86 0 top  (outside the outline)
P6  66.04,149.86 0 top  (outside the outline)
PVIN  2.54,149.86 0 top  (outside the outline)
PVOUT  99.06,149.86 0 top  (outside the outline)
R1  58.42,1.27 180 top
R2  74.93,12.7 270 top
R3  76.2,6.35 180 top
R4  60.96,49.53 180 top
R5  69.85,60.96 90 top
R6  69.85,50.8 90 top
R7  45.72,124.46 0 top  (outside the outline)
R8  76.2,124.46 0 top  (outside the outline)
R10  -6.35,27.94 270 top  (outside the outline)
SPWR  105.41,59.05 270 top
SW1  35.56,124.46 0 top  (outside the outline)
SW2  66.04,124.46 0 top  (outside the outline)
SW4  -8.89,19.05 90 top  (outside the outline)

### Tracks (layer width: path | path; a pad name or v marks a point on that pad's centre or on a via)
+5V  (via drill 1.1)
  5V 0.61: P1.3 7.54,94.06 arc90 15.24,86.36 35.56,86.36 arc90 40.64,91.44 40.64,106.6 arc90 P2.3 42.55,106.68 arc90 49.53,113.67 R7.P$2 49.53,140.89 arc90 P5.3 arc-90 55.8,165.1 63.5,165.1 arc-90 71.04,157.56 P6.3 arc-90 80.01,140.89 R8.P$2 80.01,112.39 arc-90 74.3,106.68 71.12,106.68 | 71.12,106.68 arc90 87.63,90.17 101.6,90.17 arc90 104.14,92.71 | 71.12,106.68 P3.3 | v72.39,64.77 arc106 74.93,57.15 arc-53 77.47,52.07 77.47,29.21 arc-90 v74.93,26.67 | v74.93,64.77 88.27,64.77 arc90 104.14,80.64 104.14,92.71 | 104.14,92.71 104.14,106.6 arc90 P4.3
  Bottom 0.61: R5.P$2 v72.39,64.77 v74.93,64.77 | B1.21 v74.93,26.67
+9V  (via drill 1.1)
  +9V 0.61: SPWR.P$1 arc90 97.86,69.85 57.15,69.85 arc90 v54.61,67.31
  Bottom 0.61: IC3.8 v54.61,67.31 54.61,46.99 IC2.OUT
-9V  (via drill 1.1)
  OnBoardWire2 0.61: v41.91,29.21 41.91,30.48 arc-90 53.34,39.37 59.05,39.37 arc90 67.31,47.62 67.31,54.61 arc90 v64.77,57.15
  Bottom 0.61: IC1.OUT v41.91,29.21 | IC3.4 v64.77,57.15
GND  (via drill 0.5, 1.1)  (1 unrouted)
  Ground 0.61: -2.54,149.86 -2.54,106.68 P1.1 arc90 -2.54,106.6 -2.62,106.6 arc90 -25.4,83.82 -25.4,55.88 arc90 -15.24,45.72 -10.79,45.72 arc-90 -6.35,41.27 JIN.SLEEVE | PVIN.1 -2.46,152.48 arc-90 5.08,160.02 20.4,160.02 arc-90 P5.1 30.56,152.48 arc-90 38.1,160.02 50.88,160.02 arc-90 P6.1 61.04,149.94 arc-90 68.58,157.48 86.36,157.48 arc-90 93.98,149.86 PVOUT.1 arc-90 73.74,129.54 66.04,129.54 | SW2.P$1 62.79,126.29 arc-90 66.04,129.54 | 66.04,129.54 35.56,129.54 arc90 32.31,126.29 SW1.P$1 arc90 30.48,122.63 30.48,106.68 P2.1 30.56,91.36 arc90 33.02,88.9 43.26,88.9 arc90 P3.1 61.04,93.9 arc90 66.04,88.9 76.28,88.9 arc90 P4.1 arc-90 93.98,106.76 93.98,114.3 arc-90 96.52,116.84 101.6,116.84 arc-90 116.84,101.6 116.84,40.64 arc-90 JOUT.SLEEVE 109.22,26.67 arc-90 106.68,24.13 LED1.K arc90 96.52,31.75 v80.01,31.75
  Component2Component 0.61: R10.P$1 JIN.SLEEVE
  DummyGND 0.61: B1.4 B1.23
  Bottom 0.61: D7.C 16.51,16.51 D6.C 31.75,21.59 C3.+ 31.75,39.37 | v19.05,64.77 D1.A 13.97,62.23 D4.A 21.59,49.53 21.59,39.37 31.75,39.37 | C6.2 69.85,41.91 | 69.85,41.91 R6.P$1 | 46.99,41.91 C2.- 34.29,39.37 31.75,39.37 | 46.99,41.91 IC2.GND | B1.23 74.93,31.75 | 74.93,31.75 v80.01,31.75 C1.2 | B1.4 IC1.GND 46.99,41.91 | 69.85,41.91 74.93,41.91 74.93,31.75
  other vias: 69.85,31.75
IN  (2 unrouted)
  Bottom 0.61: R5.P$1 R6.P$2
JL1  (via drill 1.1)
  Led&Switches 0.61: LED1.A 104.14,4.45 arc-90 93.34,-6.35 63.5,-6.35 arc-90 58.42,-1.27 58.42,18.41 arc153 v52.07,21.59
  Bottom 0.61: v52.07,21.59 B1.6
JP1
  Pots 0.61: B1.19 89.53,21.59 arc-90 93.98,17.14 93.98,7.62 arc-90 78.74,-7.62 -15.24,-7.62 arc-90 -27.94,5.08 -27.94,81.28 arc-90 -22.86,86.36 -7.62,86.36 arc90 2.54,96.52 P1.2
JP2
  Pots 0.61: B1.20 76.2,24.13 arc90 109.22,57.15 109.22,104.78 arc90 99.06,114.94 43.81,114.94 arc90 P2.2
JP3
  Pots 0.61: P3.2 arc-90 68.58,104.14 68.58,40.64 arc90 67.31,39.37 67.31,33.66 arc90 64.77,31.11 64.77,23.5 arc90 65.25,23.02 B1.A4
JP4
  Pots 0.61: B1.A5 66.99,28.89 arc-90 71.12,30.48 73.03,30.48 arc90 99.06,56.52 P4.2
JP5
  Pots 0.61: P5.2 35.56,135.89 arc-90 28.57,128.91 24.13,128.91 arc90 15.24,120.02 15.24,66.83 arc90 B1.A6
JP6
  Pots 0.61: B1.A7 66.2,15.08 arc-90 63.5,17.78 63.5,78.74 arc90 58.42,83.82 41.27,83.82 arc-90 26.67,98.42 26.67,113.67 arc-90 33.02,120.02 42.55,120.02 arc90 66.67,144.15 66.67,149.22 arc90 P6.2
JP8-2  (via drill 1.1)
  Audio 0.61: PVOUT.2 arc-90 109.22,160.02 111.76,160.02 arc-90 129.54,142.24 129.54,27.94 arc-90 118.11,16.51 v77.47,16.51
  Bottom 0.61: R3.P$1 C1.1 | R1.P$1 80.01,1.27 R3.P$1 | R3.P$1 77.47,6.35 v77.47,16.51 R2.P$1
JP8-3
  Audio 0.61: PVOUT.3 arc-90 111.76,142.16 111.76,53.34 arc-44 106.68,40.64 arc87 JOUT.TIP
JS1  (via drill 1.1)
  Component2Component 0.61: SW1.P$2 R7.P$1
  Led&Switches 0.61: R7.P$1 41.91,121.92 arc-90 37.47,117.47 -20.32,117.47 arc90 -37.47,100.33 -37.47,12.06 arc90 -8.89,-16.51 24.77,-16.51 arc90 36.83,-4.45 36.83,16.51 arc-90 39.37,19.05 v52.07,19.05
  Bottom 0.61: B1.7 v52.07,19.05
JS2  (via drill 1.1)
  Component2Component 0.61: R8.P$1 SW2.P$2
  Led&Switches 0.61: SW2.P$2 69.29,121.21 arc90 71.12,119.38 124.46,119.38 arc-90 137.16,106.68 137.16,0 arc-90 121.92,-15.24 63.5,-15.24 arc-90 52.07,-3.81 v52.07,11.43
  Bottom 0.61: B1.10 v52.07,11.43
MZ1
  Bottom 0.61: B1.12 R1.P$2
MZ2
  Bottom 0.61: B1.13 R3.P$2 74.93,6.35 R2.P$2
N$2
  Bottom 0.61: D6.A 3.81,21.59 D5.C 3.17,26.67 C5.-
N$4
  Bottom 0.61: D8.C 1.27,16.51 D7.A 8.89,19.05 8.89,34.29 C4.-
N$5
  Bottom 0.61: D3.C 19.05,54.61 | 19.05,54.61 D2.C | 19.05,54.61 26.67,54.61 26.67,46.99 | 26.67,46.99 C2.+ | IC2.IN 26.67,46.99
N$6  (via drill 1)
  +9V 0.61: SPWR.P$2 arc-90 83.89,34.29 v73.03,34.29 B1.24
N$7  (via drill 1.1)
  OnBoardWire1 0.61: v44.45,29.21 44.45,30.48 arc90 40.64,36.83 v26.67,36.83
  Bottom 0.61: D8.A 11.43,24.13 D5.A 24.13,26.67 C3.- v26.67,36.83 | IC1.IN v44.45,29.21
N$8
  Bottom 0.61: C7.- R4.P$2 IC3.1
N$9  (via drill 1.1)
  Audio 0.61: PVIN.2 arc-90 22.86,129.54 22.86,83.82 arc90 33.02,73.66 38.1,73.66 arc-90 52.07,59.69 52.07,55.88 arc90 55.88,52.07 v59.69,52.07
  Bottom 0.61: R4.P$1 64.77,52.07 v59.69,52.07 IC3.2
N$10  (via drill 1.1)  (1 unrouted)
  Component2Component 0.61: JIN.TIP arc90 -17.78,27.94 -17.78,22.86 arc90 v-11.43,19.05
N$11  (2 unrouted)
N$15  (1 unrouted)
N$32  (1 unrouted)
  Bottom 0.61: C6.1 C7.+
PWRSLV  (via drill 1.1)
  OnBoardWire1 0.61: JPWR.GND -11.35,57.23 arc-90 -5.08,63.5 -2.54,63.5 arc-90 v3.81,57.15
  Bottom 0.61: D3.A 3.81,54.61 | 3.81,54.61 D4.C 3.81,44.45 13.97,44.45 C4.+ | 3.81,54.61 v3.81,57.15
PWRTIP  (via drill 1.1)
  OnBoardWire2 0.61: JPWR.PWR -5.35,55.52 arc90 -1.91,52.07 v1.27,52.07
  Bottom 0.61: D2.A 6.35,59.69 | 6.35,59.69 D1.C | C5.+ 1.27,39.37 v1.27,52.07 1.27,59.69 6.35,59.69

### Text on the board
Measures: 25 holes (vertical) | 32 holes (horizontal)
Reference: b | a | Z | Y | X | W | V | U | T | S | R | Q | P | O | N | M | L | K | J | I | H | G | F | E | D | C | B | A | 1 | 2 | 3 | 4 | 5 | 6 | 7 | 8 | 6 | 7 | 8 | 9 | 20 | 1 | 2 | 6 | 7 | 8 | 9 | 30 | 1 | 2 | 9 | 10 | 1 | 2 | 3 | 4 | 5 | 3 | 4 | 5